# EAGLE design Rev 06_2 (EAGLE 9.6.2)
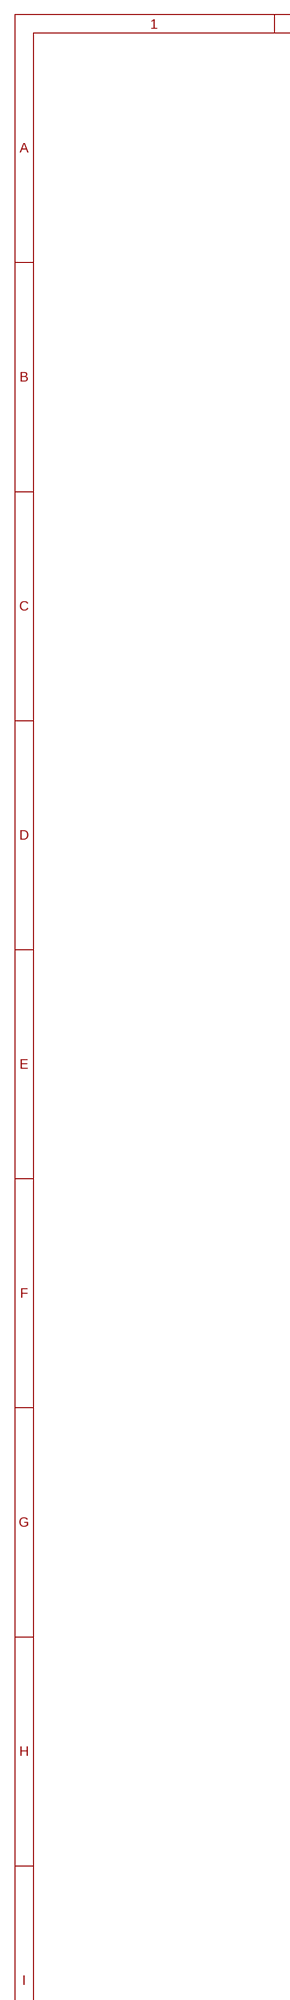
[diagram p0: schematic, sheet 1, part 1 of 2]
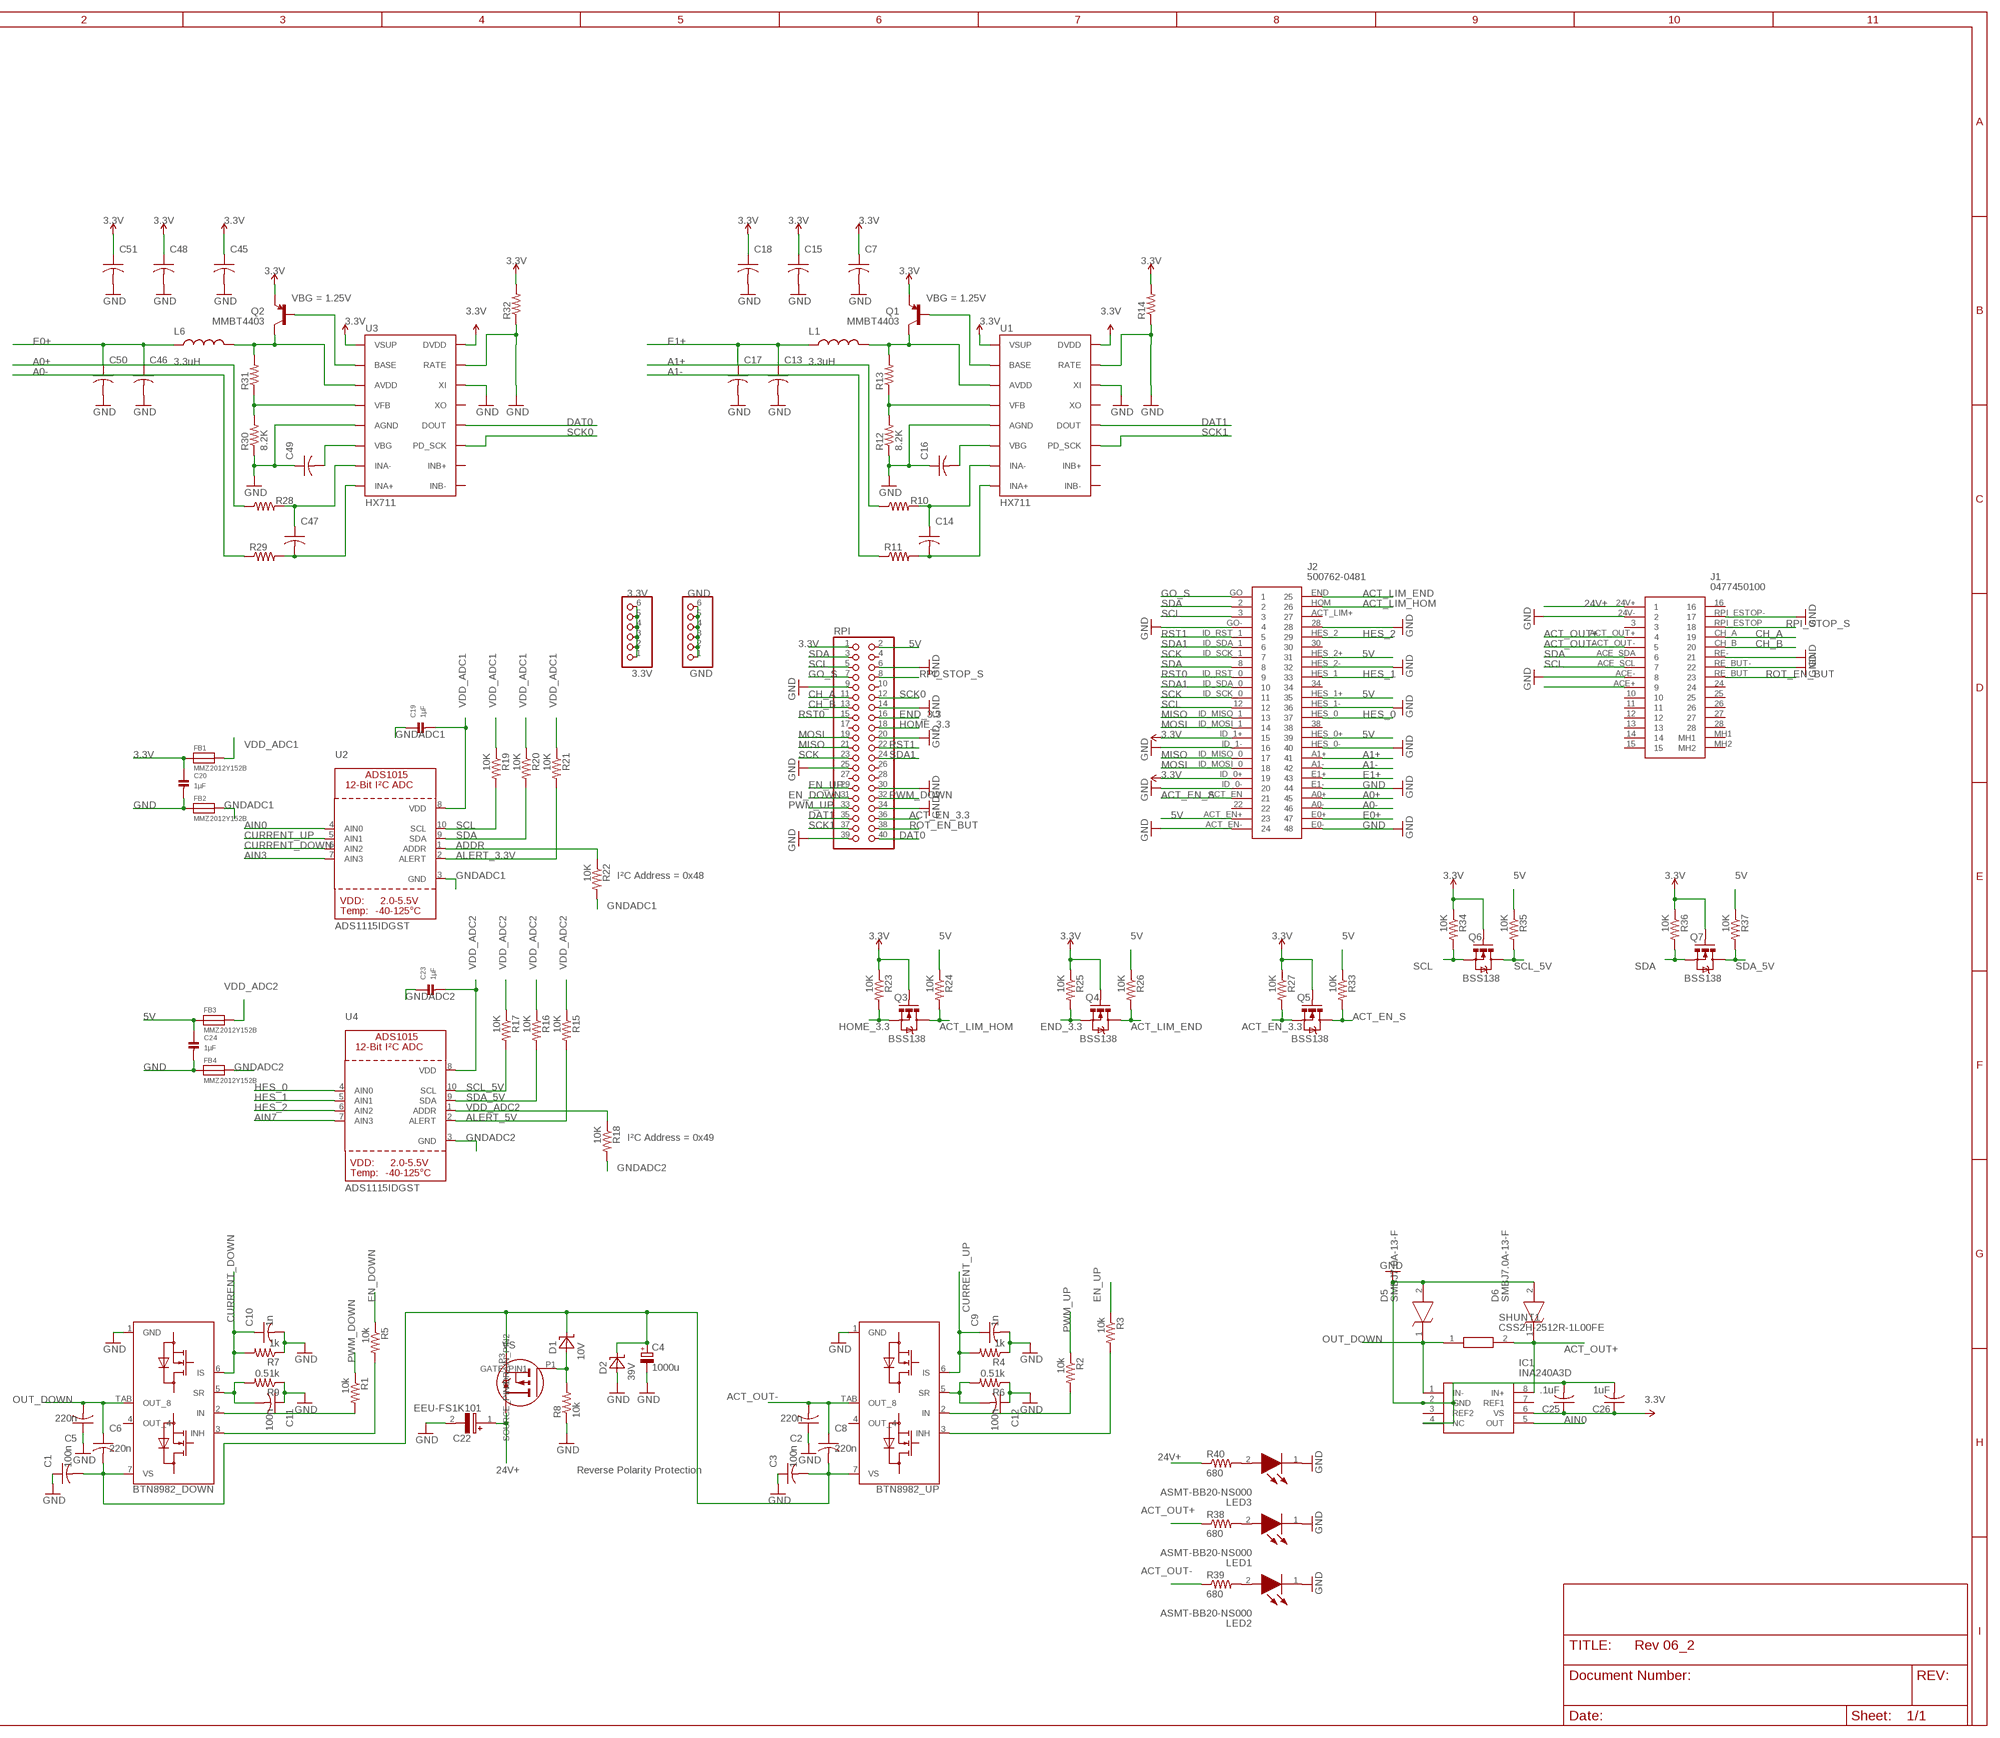
[diagram p1: schematic, sheet 1, part 2 of 2]

## Parts
3.3V  PINHD-1X6  [1X06]
BTN8982_DOWN  HW-INFINEON_BTN8982  HW-INFINEON_BTN8962TA  [HW-INFINEON_TO263-7-1]
BTN8982_UP  HW-INFINEON_BTN8982  HW-INFINEON_BTN8962TA  [HW-INFINEON_TO263-7-1]
C1  100n  C-USC0603K  [C0603K]
C2  220n  C-USC0603K  [C0603K]
C3  100n  C-USC0603K  [C0603K]
C4  1000u  RCL_CPOL-EUE5-13  [RCL_E5-13]
C5  220n  C-USC0603K  [C0603K]
C6  220n  C-USC0603K  [C0603K]
C7  10uF  C-USC1206K  [C1206K]
C8  220n  C-USC0603K  [C0603K]
C9  1n  C-USC0603K  [C0603K]
C10  1n  C-USC0603K  [C0603K]
C11  100n  C-USC0603  [C0603]
C12  100n  C-USC0603K  [C0603K]
C13  10uF  C-USC1206K  [C1206K]
C14  0.1uF  C-USC1206K  [C1206K]
C15  0.1uF  C-USC1206K  [C1206K]
C16  0.1uF  C-USC1206K  [C1206K]
C17  0.1uF  C-USC1206K  [C1206K]
C18  0.1uF  C-USC1206K  [C1206K]
C19  1µF  CAP_CERAMIC1206  [1206]
C20  1µF  CAP_CERAMIC1206  [1206]
C22  EEU-FS1K101  [CAPPRD500W65D1000H1400]
C23  1µF  CAP_CERAMIC1206  [1206]
C24  1µF  CAP_CERAMIC1206  [1206]
C25  .1uF  C-USC1206K  [C1206K]
C26  1uF  C-USC1206K  [C1206K]
C45  10uF  C-USC1206K  [C1206K]
C46  10uF  C-USC1206K  [C1206K]
C47  0.1uF  C-USC1206K  [C1206K]
C48  0.1uF  C-USC1206K  [C1206K]
C49  0.1uF  C-USC1206K  [C1206K]
C50  0.1uF  C-USC1206K  [C1206K]
C51  0.1uF  C-USC1206K  [C1206K]
D1  10V  SMD-PACKAGES_ZMM  [SMD-PACKAGES_SOD80]
D2  39V  SMD-PACKAGES_ZMMM  [SMD-PACKAGES_MELF-D]
D5  SMBJ7.0A-13-F  [DIOM5336X250N]
D6  SMBJ7.0A-13-F  [DIOM5336X250N]
FB1  MMZ2012Y152B  FERRITE0805  [0805]
FB2  MMZ2012Y152B  FERRITE0805  [0805]
FB3  MMZ2012Y152B  FERRITE0805  [0805]
FB4  MMZ2012Y152B  FERRITE0805  [0805]
GND  PINHD-1X6  [1X06]
IC0  HW_INFINEON_IPD90P04P4L-04  [HW-INFINEON_TO-252-3-313-L]
IC1  INA240A3D  [SOIC127P600X175-8N]
J1  0477450100  [0477450100]
J2  500762-0481  [500762-0481]
L1  3.3uH  INDUCTOR1210  [1210]
L6  3.3uH  INDUCTOR1210  [1210]
LED1  ASMT-BB20-NS000  [LEDM3224X250N]
LED2  ASMT-BB20-NS000  [LEDM3224X250N]
LED3  ASMT-BB20-NS000  [LEDM3224X250N]
Q1  MMBT4403  TRANSISTOR_PNPMMBT4403  [SOT23-3]
Q2  MMBT4403  TRANSISTOR_PNPMMBT4403  [SOT23-3]
Q3  BSS138  MOSFET-NCHANNELSMD  [SOT23-3]
Q4  BSS138  MOSFET-NCHANNELSMD  [SOT23-3]
Q5  BSS138  MOSFET-NCHANNELSMD  [SOT23-3]
Q6  BSS138  MOSFET-NCHANNELSMD  [SOT23-3]
Q7  BSS138  MOSFET-NCHANNELSMD  [SOT23-3]
R1  10k  RESISTOR0603-RES  [0603-RES]
R2  10k  RESISTOR0603-RES  [0603-RES]
R3  10k  RESISTOR0603-RES  [0603-RES]
R4  1k  RESISTOR0603-RES  [0603-RES]
R5  10k  RESISTOR0603-RES  [0603-RES]
R6  0.51k  RESISTOR0603-RES  [0603-RES]
R7  1k  RESISTOR0603-RES  [0603-RES]
R8  10k  RESISTOR0603-RES  [0603-RES]
R9  0.51k  RESISTOR0603-RES  [0603-RES]
R10  100  R-US_R2010  [R2010]
R11  100  R-US_R2010  [R2010]
R12  8.2K  R-US_R2010  [R2010]
R13  20k  R-US_R2010  [R2010]
R14  10K  R-US_R2010  [R2010]
R15  10K  RESISTOR2010  [R2010]
R16  10K  RESISTOR2010  [R2010]
R17  10K  RESISTOR2010  [R2010]
R18  10K  RESISTOR2010  [R2010]
R19  10K  RESISTOR2010  [R2010]
R20  10K  RESISTOR2010  [R2010]
R21  10K  RESISTOR2010  [R2010]
R22  10K  RESISTOR2010  [R2010]
R23  10K  RESISTOR2010  [R2010]
R24  10K  RESISTOR2010  [R2010]
R25  10K  RESISTOR2010  [R2010]
R26  10K  RESISTOR2010  [R2010]
R27  10K  RESISTOR2010  [R2010]
R28  100  R-US_R2010  [R2010]
R29  100  R-US_R2010  [R2010]
R30  8.2K  R-US_R2010  [R2010]
R31  20k  R-US_R2010  [R2010]
R32  10K  R-US_R2010  [R2010]
R33  10K  RESISTOR2010  [R2010]
R34  10K  RESISTOR2010  [R2010]
R35  10K  RESISTOR2010  [R2010]
R36  10K  RESISTOR2010  [R2010]
R37  10K  RESISTOR2010  [R2010]
R38  680  RESISTOR1206  [1206]
R39  680  RESISTOR1206  [1206]
R40  680  RESISTOR1206  [1206]
RPI  PINHD-2X20  [2X20]
SHUNT1  CSS2H-2512R-1L00FE  [CSS2H2512R1L00FE]
U1  HX711  HX711HX711  [SO16]
U2  ADS1115IDGST  ADC_ADS1015  [MSOP10]
U3  HX711  HX711HX711  [SO16]
U4  ADS1115IDGST  ADC_ADS1015  [MSOP10]

## Nets
3.3V: 3.3V.1 3.3V.2 3.3V.3 3.3V.4 3.3V.5 3.3V.6 C7.1 C15.1 C18.1 C20.1 C25.1 C26.1 C45.1 C48.1 C51.1 FB1.1 IC1.6(VS) J2.ID_0+ J2.ID_1+ Q1.2(E) Q2.2(E) Q3.1(G) Q4.1(G) Q5.1(G) Q6.1(G) Q7.1(G) R14.2 R23.1 R25.1 R27.1 R32.2 R34.1 R36.1 RPI.1(3.3V0) U1.1(VSUP) U1.16(DVDD) U3.1(VSUP) U3.16(DVDD) ; supply symbol labelled VDD, VCC, LV
5V: C24.1 FB3.1 J2.ACT_EN+ J2.HES_0+ J2.HES_1+ J2.HES_2+ R24.1 R26.1 R33.1 R35.1 R37.1 RPI.2(5V0)
24V+: C22.1(+) IC0.P2(DRAIN_PIN2) J1.24V+ R40.1
A0+: J2.A0+ R28.1
A0-: J2.A0- R29.1
A1+: J2.A1+ R10.1
A1-: J2.A1- R11.1
ACT_EN_3.3: Q5.2(S) R27.2 RPI.36
ACT_EN_S: J2.ACT_EN Q5.3(D) R33.2
ACT_LIM_END: J2.END Q4.3(D) R26.2
ACT_LIM_HOM: J2.HOM Q3.3(D) R24.2
ACT_OUT+: D6.1(K) IC1.8(IN+) J1.ACT_OUT+ R38.1 SHUNT1.2
ACT_OUT-: BTN8982_UP.TAB(OUT_8) C2.2 C8.1 J1.ACT_OUT- R39.1
ADDR: R22.1 U2.1(ADDR)
AIN0: IC1.5(OUT) U2.4(AIN0)
AIN3: U2.7(AIN3)
AIN7: U4.7(AIN3)
ALERT_3.3V: R21.2 U2.2(ALERT)
ALERT_5V: R15.2 U4.2(ALERT)
CH_A: J1.CH_A RPI.11
CH_B: J1.CH_B RPI.13
CURRENT_DOWN: BTN8982_DOWN.6(IS) C10.1 R7.2 U2.6(AIN2)
CURRENT_UP: BTN8982_UP.6(IS) C9.1 R4.2 U2.5(AIN1)
DAT0: RPI.40 U3.12(DOUT)
DAT1: RPI.35 U1.12(DOUT)
E0+: C46.1 C50.1 J2.E0+ L6.1
E1+: C13.1 C17.1 J2.E1+ L1.1
EN_DOWN: R5.1 RPI.31
EN_UP: R3.1 RPI.29
END_3.3: Q4.2(S) R25.2 RPI.16
GND: BTN8982_DOWN.1(GND) BTN8982_UP.1(GND) C1.1 C2.1 C3.1 C4.- C5.1 C7.2 C9.2 C10.2 C11.1 C12.1 C13.2 C15.2 C16.1 C17.2 C18.2 C20.2 C22.2(-) C24.2 C25.2 C26.2 C45.2 C46.2 C48.2 C49.1 C50.2 C51.2 D2.A D5.2(A) D6.2(A) FB2.1 FB4.1 GND.1 GND.2 GND.3 GND.4 GND.5 GND.6 IC1.2(GND) IC1.4(NC) J1.24V- J1.ACE- J1.RE- J1.RE_BUT- J1.RPI_ESTOP- J2.28 J2.ACT_EN- J2.E0- J2.E1- J2.GO- J2.HES_0- J2.HES_1- J2.HES_2- J2.ID_0- J2.ID_1- LED1.1(K) LED2.1(K) LED3.1(K) R4.1 R6.1 R7.1 R8.1 R9.1 R12.1 R14.1 R30.1 R32.1 RPI.6(GND4) RPI.9(GND0) RPI.14(GND5) RPI.20(GND6) RPI.25(GND1) RPI.30(GND7) RPI.34(GND8) RPI.39(GND3) U1.5(AGND) U1.14(XI) U1.15(RATE) U3.5(AGND) U3.14(XI) U3.15(RATE)
GNDADC1: C19.1 FB2.2 R22.2 U2.3(GND)
GNDADC2: C23.1 FB4.2 R18.2 U4.3(GND)
GO_S: J2.GO RPI.7
HES_0: J2.HES_0 U4.4(AIN0)
HES_1: J2.HES_1 U4.5(AIN1)
HES_2: J2.HES_2 U4.6(AIN2)
HOME_3.3: Q3.2(S) R23.2 RPI.18
IN2: BTN8982_UP.2(IN) R2.2
INH1: BTN8982_DOWN.3(INH) R5.2
INH2: BTN8982_UP.3(INH) R3.2
MISO: J2.ID_MISO_0 J2.ID_MISO_1 RPI.21
MOSI: J2.ID_MOSI_0 J2.ID_MOSI_1 RPI.19
N$1: BTN8982_DOWN.2(IN) R1.2
N$2: Q1.1(B) U1.2(BASE)
N$3: R12.2 R13.1 U1.4(VFB)
N$4: C16.2 U1.6(VBG)
N$5: L1.2 Q1.3(C) R13.2 U1.3(AVDD)
N$6: C14.1 R10.2 U1.7(INA-)
N$7: C14.2 R11.2 U1.8(INA+)
N$8: LED1.2(A) R38.2
N$9: D1.A IC0.P1(GATE_PIN1) R8.2
N$10: LED2.2(A) R39.2
N$11: LED3.2(A) R40.2
N$12: J1.ACE+
N$56: Q2.1(B) U3.2(BASE)
N$63: R30.2 R31.1 U3.4(VFB)
N$64: C49.2 U3.6(VBG)
N$65: L6.2 Q2.3(C) R31.2 U3.3(AVDD)
N$67: C47.1 R28.2 U3.7(INA-)
N$68: C47.2 R29.2 U3.8(INA+)
OUT_DOWN: BTN8982_DOWN.TAB(OUT_8) C5.2 C6.1 D5.1(K) IC1.1(IN-) SHUNT1.1
PWM_DOWN: R1.1 RPI.32
PWM_UP: R2.1 RPI.33
ROT_EN_BUT: J1.RE_BUT RPI.38
RPI_STOP_S: J1.RPI_ESTOP RPI.8
RST0: J2.ID_RST_0 RPI.15
RST1: J2.ID_RST_1 RPI.22
SCK: J2.ID_SCK_0 J2.ID_SCK_1 RPI.23
SCK0: RPI.12 U3.11(PD_SCK)
SCK1: RPI.37 U1.11(PD_SCK)
SCL: J1.ACE_SCL J2.3 J2.12 Q6.2(S) R19.2 R34.2 RPI.5 U2.10(SCL)
SCL_5V: Q6.3(D) R17.2 R35.2 U4.10(SCL)
SDA: J1.ACE_SDA J2.2 J2.8 Q7.2(S) R20.2 R36.2 RPI.3 U2.9(SDA)
SDA1: J2.ID_SDA_0 J2.ID_SDA_1 RPI.24
SDA_5V: Q7.3(D) R16.2 R37.2 U4.9(SDA)
SR1: BTN8982_DOWN.5(SR) C11.2 R9.2
SR2: BTN8982_UP.5(SR) C12.2 R6.2
VDD_ADC1: C19.2 FB1.2 R19.1 R20.1 R21.1 U2.8(VDD)
VDD_ADC2: C23.2 FB3.2 R15.1 R16.1 R17.1 R18.1 U4.1(ADDR) U4.8(VDD)
VS: BTN8982_DOWN.7(VS) BTN8982_UP.7(VS) C1.2 C3.2 C4.+ C6.2 C8.2 D1.K(C) D2.K(C) IC0.P3(SOURCE_PIN3)
Unconnected: BTN8982_DOWN.4(OUT_4) BTN8982_UP.4(OUT_4) IC1.3(REF2) IC1.7(REF1) J1.3 J1.10 J1.11 J1.12 J1.13 J1.14 J1.15 J1.16 J1.24 J1.25 J1.26 J1.27 J1.28 J1.MH1 J1.MH2 J2.22 J2.30 J2.34 J2.38 J2.ACT_LIM+ RPI.4(5V1) RPI.10 RPI.17(3.3V1) RPI.26 RPI.27(---------------) RPI.28(---) U1.9(INB-) U1.10(INB+) U1.13(XO) U3.9(INB-) U3.10(INB+) U3.13(XO)

## Notes on the sheet
- VBG = 1.25V | VBG = 1.25V
- I²C Address = 0x48
- I²C Address = 0x49
- Reverse Polarity Protection

## Library data of the parts
3.3V GND = adafruit:PINHD-1X6: PIN HEADER
BTN8982_DOWN BTN8982_UP = NovalithIC_H-Bridge_Demo_Board_V2_2:HW-INFINEON_BTN8962TA
C1-C3 C5-C18 C25 C26 C45-C51 = rcl:C-US: CAPACITOR, American symbol; SPICEPREFIX: C
C4 = NovalithIC_H-Bridge_Demo_Board_V2_2:RCL_CPOL-EU: POLARIZED CAPACITOR, European symbol
C19 C20 C23 C24 = microbuilder:CAP_CERAMIC: Ceramic Capacitors 0402 - 0402 Surface Mount Capacitors 16pF 50V 5% [Digikey: 445-4899-2-ND] 18pF 50V 5% [Digikey: 490-1281-2-ND] 22pF 50V 5% [Digikey: 490-1283-2-ND] 68pF 50V 5% [Digikey: 490-1289-2-ND] 0.1uF 10V 10% [Digikey: 490-1318-2-ND] 1.0uF 6.3V 10% [Digikey: 490-1320-2-ND] 0603 - 0603 Surface Mount Capacitors 16 pF 50V 5% [Digikey: 445-5051-2-ND] 22 pF 50V [Digikey: PCC220ACVTR-ND] 33 pF 50V 5% [Digikey: 490-1415-1-ND] 56pF 50V 5% [Digikey: 490-1421-1-ND] 220pF 50V 5% [Digikey: 445-1285-1-ND] 680 pF 50V 2200 pF 50V 5% C0G [Digikey: 445-1297-1-ND] 5600 pF 100V 5% X7R [Digikey: 478-3711-1-ND] 0.1 µF 25V 10% [Digikey: PCC2277TR-ND] 0.22 µF 16V 10% X7R [Digikey: 445-1318-1-ND] 1.0 µF 25V 10% [Digikey: 445-5146-2-ND] 0603 - RF Specific 3pF 250V +/-0.1pF RF [Digikey: 712-1347-1-ND] 18 pF 250V 5% [Digikey: 478-3505-1-ND or 712-1322-1-ND] 56 pF 250V 5% C0G RF [Digikey: 490-4867-1-ND] 68 pF 250V RF [Digikey: 490-4868-1-ND] 0805 - 0805 Surface Mount Capacitors 220 pF 250V 2% RF Ceramic Capacitor [Digikey: 712-1398-1-ND] 1000 pF 50V 2% NP0 Ceramic Capacitor [Digikey: 478-3760-1-ND] 0.1 µF 25V 10% Ceramic Capacitor [Digikey: PCC1828TR-ND] 1.0 µF 16V 10% Ceramic Capacitor[Digikey: 490-1691-2-ND] 10.0 µF 10V 10% Ceramic Capacitor[Digikey: 709-1228-1-ND] 10.0 uF 16V 10% Ceramic Capacitor [Digikey: 478-5165-2-ND] 47 uF 6.3V 20% Ceramic Capacitor [Digikey: 587-1779-1-ND or 399-5506-1-ND] 1206 - 1206 Surface Mount Capacitors 47uF 10V 20% Ceramic Capacitor [Digikey: 490-5528-1-ND or 399-5508-1-ND or 445-6010-1-ND] 100uF 6.3V -20%, +80% Y5V Ceramic Capacitor (Digikey: 490-4512-1-ND, Mouser: 81-GRM31CF50J107ZE1L)
C22 = EEU-FS1K101:EEU-FS1K101: Aluminum Electrolytic Capacitors - Radial Leaded 80VDC 100uF 600mA Polar Source: Datasheet <http://industrial.panasonic.com/cdbs/www-data/pdf/RDF0000/ABA0000C1255.pdf>; ARROW_PART_NUMBER: EEU-FS1K101; ARROW_PRICE-STOCK: https://www.arrow.com/en/products/eeu-fs1k101/panasonic?region=nac; DESCRIPTION: Aluminum Electrolytic Capacitors - Radial Leaded 80VDC 100uF 600mA Polar; HEIGHT: 14mm; MANUFACTURER_NAME: Panasonic; MANUFACTURER_PART_NUMBER: EEU-FS1K101; MOUSER_PART_NUMBER: 667-EEU-FS1K101; MOUSER_PRICE-STOCK: https://www.mouser.co.uk/ProductDetail/Panasonic/EEU-FS1K101?qs=w%2Fv1CP2dgqpI89RhWErXfg%3D%3D
D1 D2 = NovalithIC_H-Bridge_Demo_Board_V2_2:SMD-PACKAGES_ZMM: Werte: 1V, 2,7V ...51V Reihe E24
D5 D6 = SMBJ7.0A-13-F:SMBJ7.0A-13-F: ESD Suppressors / TVS Diodes 600W 7.0V Source: Datasheet <https://www.diodes.com/assets/Datasheets/ds19002.pdf>; ARROW_PART_NUMBER: SMBJ7.0A-13-F; ARROW_PRICE-STOCK: https://www.arrow.com/en/products/smbj7.0a-13-f/diodes-incorporated?region=nac; DESCRIPTION: ESD Suppressors / TVS Diodes 600W 7.0V; HEIGHT: 2.5mm; MANUFACTURER_NAME: Diodes Inc.; MANUFACTURER_PART_NUMBER: SMBJ7.0A-13-F; MOUSER_PART_NUMBER: 621-SMBJ7.0A-13-F; MOUSER_PRICE-STOCK: https://www.mouser.co.uk/ProductDetail/Diodes-Incorporated/SMBJ70A-13-F?qs=gaDBXWSqsDCxwFOt1XoPyw%3D%3D
FB1-FB4 = microbuilder:FERRITE: Ferrite Bead 0603 MMZ1608B121C - 120 Ohm, 600mA Ferrite Chip - Digikey: 445-2164-1-ND BK1608HW121-T - 120 Ohm, 600mA Ferrite Chip - Digikey: 587-1876-2-ND 0805 HZ0805B272R-10 - 2.7K Ohm @ 100MHz, 200mA 0.8 Ohm DC Resistance - Digikey: 240-2504-1-ND (see also Murata BLM21BD272SN1L)
IC0 = NovalithIC_H-Bridge_Demo_Board_V2_2:HW_INFINEON_IPD90P04P4L-04
IC1 = INA240A3D:INA240A3D: 80V, Low-/High-Side, Bi-Directional, Zero-Drift, Current Sense Amp w/Enhanced PWM Rejection Source: Datasheet <http://www.ti.com/lit/gpn/INA240>; ARROW_PART_NUMBER: INA240A3D; ARROW_PRICE-STOCK: https://www.arrow.com/en/products/ina240a3d/texas-instruments; DESCRIPTION: 80V, Low-/High-Side, Bi-Directional, Zero-Drift, Current Sense Amp w/Enhanced PWM Rejection; HEIGHT: 1.75mm; MANUFACTURER_NAME: Texas Instruments; MANUFACTURER_PART_NUMBER: INA240A3D; MOUSER_PART_NUMBER: 595-INA240A3D; MOUSER_PRICE-STOCK: https://www.mouser.co.uk/ProductDetail/Texas-Instruments/INA240A3D?qs=u4fy%2FsgLU9Mkzv3nsq%252BxLA%3D%3D
J1 = 0477450100:0477450100: Conn CMC PIN 28 POS Solder RA Thru-Hole Automotive Carton Source: Datasheet <https://www.molex.com/pdm_docs/sd/477450100_sd.pdf>; ARROW_PART_NUMBER: 0477450100; ARROW_PRICE-STOCK: https://www.arrow.com/en/products/0477450100/molex; DESCRIPTION: Conn CMC PIN 28 POS Solder RA Thru-Hole Automotive Carton; HEIGHT: 28mm; MANUFACTURER_NAME: Molex; MANUFACTURER_PART_NUMBER: 0477450100
J2 = 500762-0481:500762-0481: CMC Header Right Angle 48 Circuits Molex 500762-0481, 48 Way 4 Row Black CMC Series Male Through Hole Header, Solder Termination Source: Datasheet <https://datasheet.datasheetarchive.com/originals/distributors/Datasheets_SAMA/7c53a4fb757944cf2c1fd37c9b3ea65a.pdf>; DESCRIPTION: CMC Header Right Angle 48 Circuits Molex 500762-0481, 48 Way 4 Row Black CMC Series Male Through Hole Header, Solder Termination; HEIGHT: mm; MANUFACTURER_NAME: Molex; MANUFACTURER_PART_NUMBER: 500762-0481; MOUSER_PART_NUMBER: 538-500762-0481; MOUSER_PRICE-STOCK: https://www.mouser.co.uk/ProductDetail/Molex/500762-0481?qs=xbccQsLEe0dknz6%252B2aFPdA%3D%3D
L1 L6 = SparkFun-Passives:INDUCTOR: Inductors Basic Inductor/Choke - 0603 and 1206. Footprints are not proven and vary greatly between part numbers. INDUCTOR POWER 3.3UH 4.0A SMD 0.197" L x 0.197" W x 0.177" H (5.00mm x 5.00mm x 4.50mm)
LED1-LED3 = ASMT-BB20-NS000:ASMT-BB20-NS000: 3.2 V Blue LED 3224 (1209) SMD, Broadcom ASMT-BB20-NS000 Source: Datasheet <https://docs.broadcom.com/docs/AV02-0389EN>; DESCRIPTION: 3.2 V Blue LED 3224 (1209) SMD, Broadcom ASMT-BB20-NS000; HEIGHT: 2.5mm; MANUFACTURER_NAME: Avago Technologies; MANUFACTURER_PART_NUMBER: ASMT-BB20-NS000; MOUSER_PART_NUMBER: 630-ASMT-BB20-NS000; MOUSER_PRICE-STOCK: https://www.mouser.co.uk/ProductDetail/Broadcom-Avago/ASMT-BB20-NS000?qs=ZNK0BnemlqHu9jR9EAVrBw%3D%3D
Q1 Q2 = SparkFun-DiscreteSemi:TRANSISTOR_PNP: Generic PNP BJT Double check pinouts against datasheets- not all devices are the same! MMBT3906 - 40V 200mA SOT-23 (TRANS-08052) MMBT4403 - 40V 600mA SOT-23 (TRANS-09245); PROD_ID: TRANS-09245
Q3-Q7 = SparkFun:MOSFET-NCHANNEL
R1-R9 R15-R27 R33-R40 = SparkFun:RESISTOR: Resistor Basic schematic elements and footprints for 0603, 1206, and PTH resistors.
R10-R14 R28-R32 = rcl:R-US_: RESISTOR, American symbol; SPICEPREFIX: R
RPI = Raspberry Pi Headers:PINHD-2X20: PIN HEADER
SHUNT1 = CSS2H-2512R-1L00FE:CSS2H-2512R-1L00FE: Res Metal Strip 2512 0.001 Ohm 1% 5W +/-75ppm/C Pad SMD Automotive T/R Source: Datasheet <http://www.bourns.com/docs/Product-Datasheets/css2h-2512.pdf>; ARROW_PART_NUMBER: CSS2H-2512R-1L00FE; ARROW_PRICE-STOCK: https://www.arrow.com/en/products/css2h-2512r-1l00fe/bourns?region=nac; DESCRIPTION: Res Metal Strip 2512 0.001 Ohm 1% 5W +/-75ppm/C Pad SMD Automotive T/R; HEIGHT: 0.87mm; MANUFACTURER_NAME: Bourns; MANUFACTURER_PART_NUMBER: CSS2H-2512R-1L00FE; MOUSER_PART_NUMBER: 652-CSS2H2512R1L00FE; MOUSER_PRICE-STOCK: https://www.mouser.co.uk/ProductDetail/Bourns/CSS2H-2512R-1L00FE?qs=jDo7WO9B8muVb3lAsH3s1A%3D%3D
U1 U3 = Testing:HX711; PROD_ID: IC-12445
U2 U4 = microbuilder:ADC_ADS1015: ADS1015 - 12-bit 4-Channel I2C ADC with Internal PGA VDD: 2.0-5.5V Sampling Rate: 3.3ksps Gain Settings: 2/3, 1, 2, 4, 8, 16 I2C Address: ADDR low = 1001000x, ADDR high = 1001001x Internal Comparator The ADS1015 includes an internal comparator that can be set to output a high-level on ALERT when the conversion results exceeeds a pre-defined upper level, and will deassert itself when the level falls below a pre-defined lower threshold level. It can also be set to windowed mode where the ALERT pin will be asserted if the data exceeds the upper threshold or falls below the lower threshold.

## Board
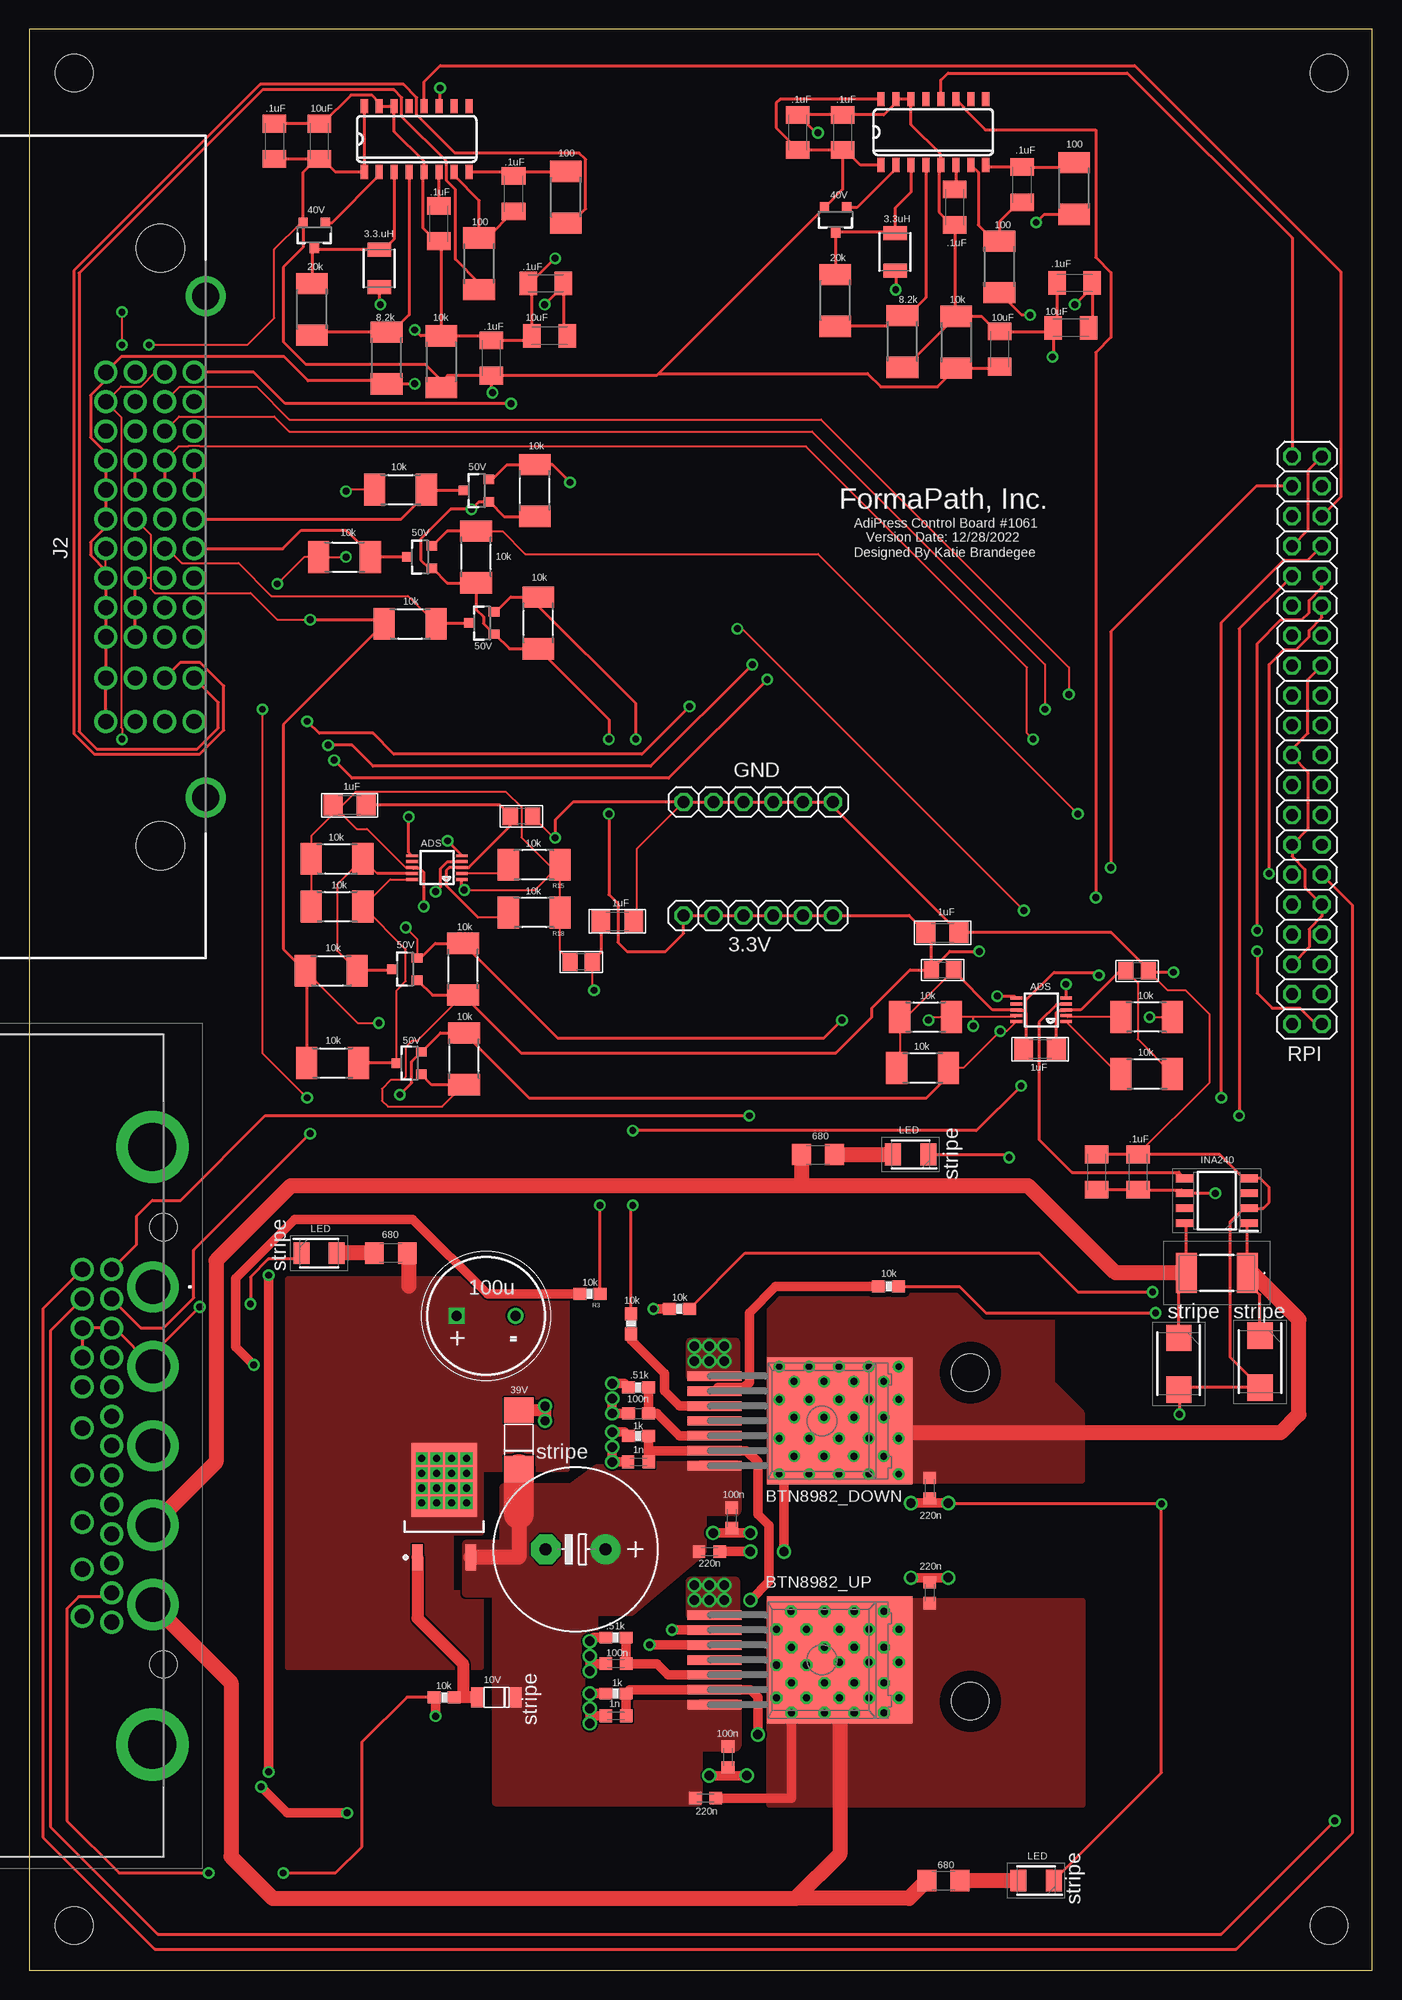
[diagram p2: board, top side]
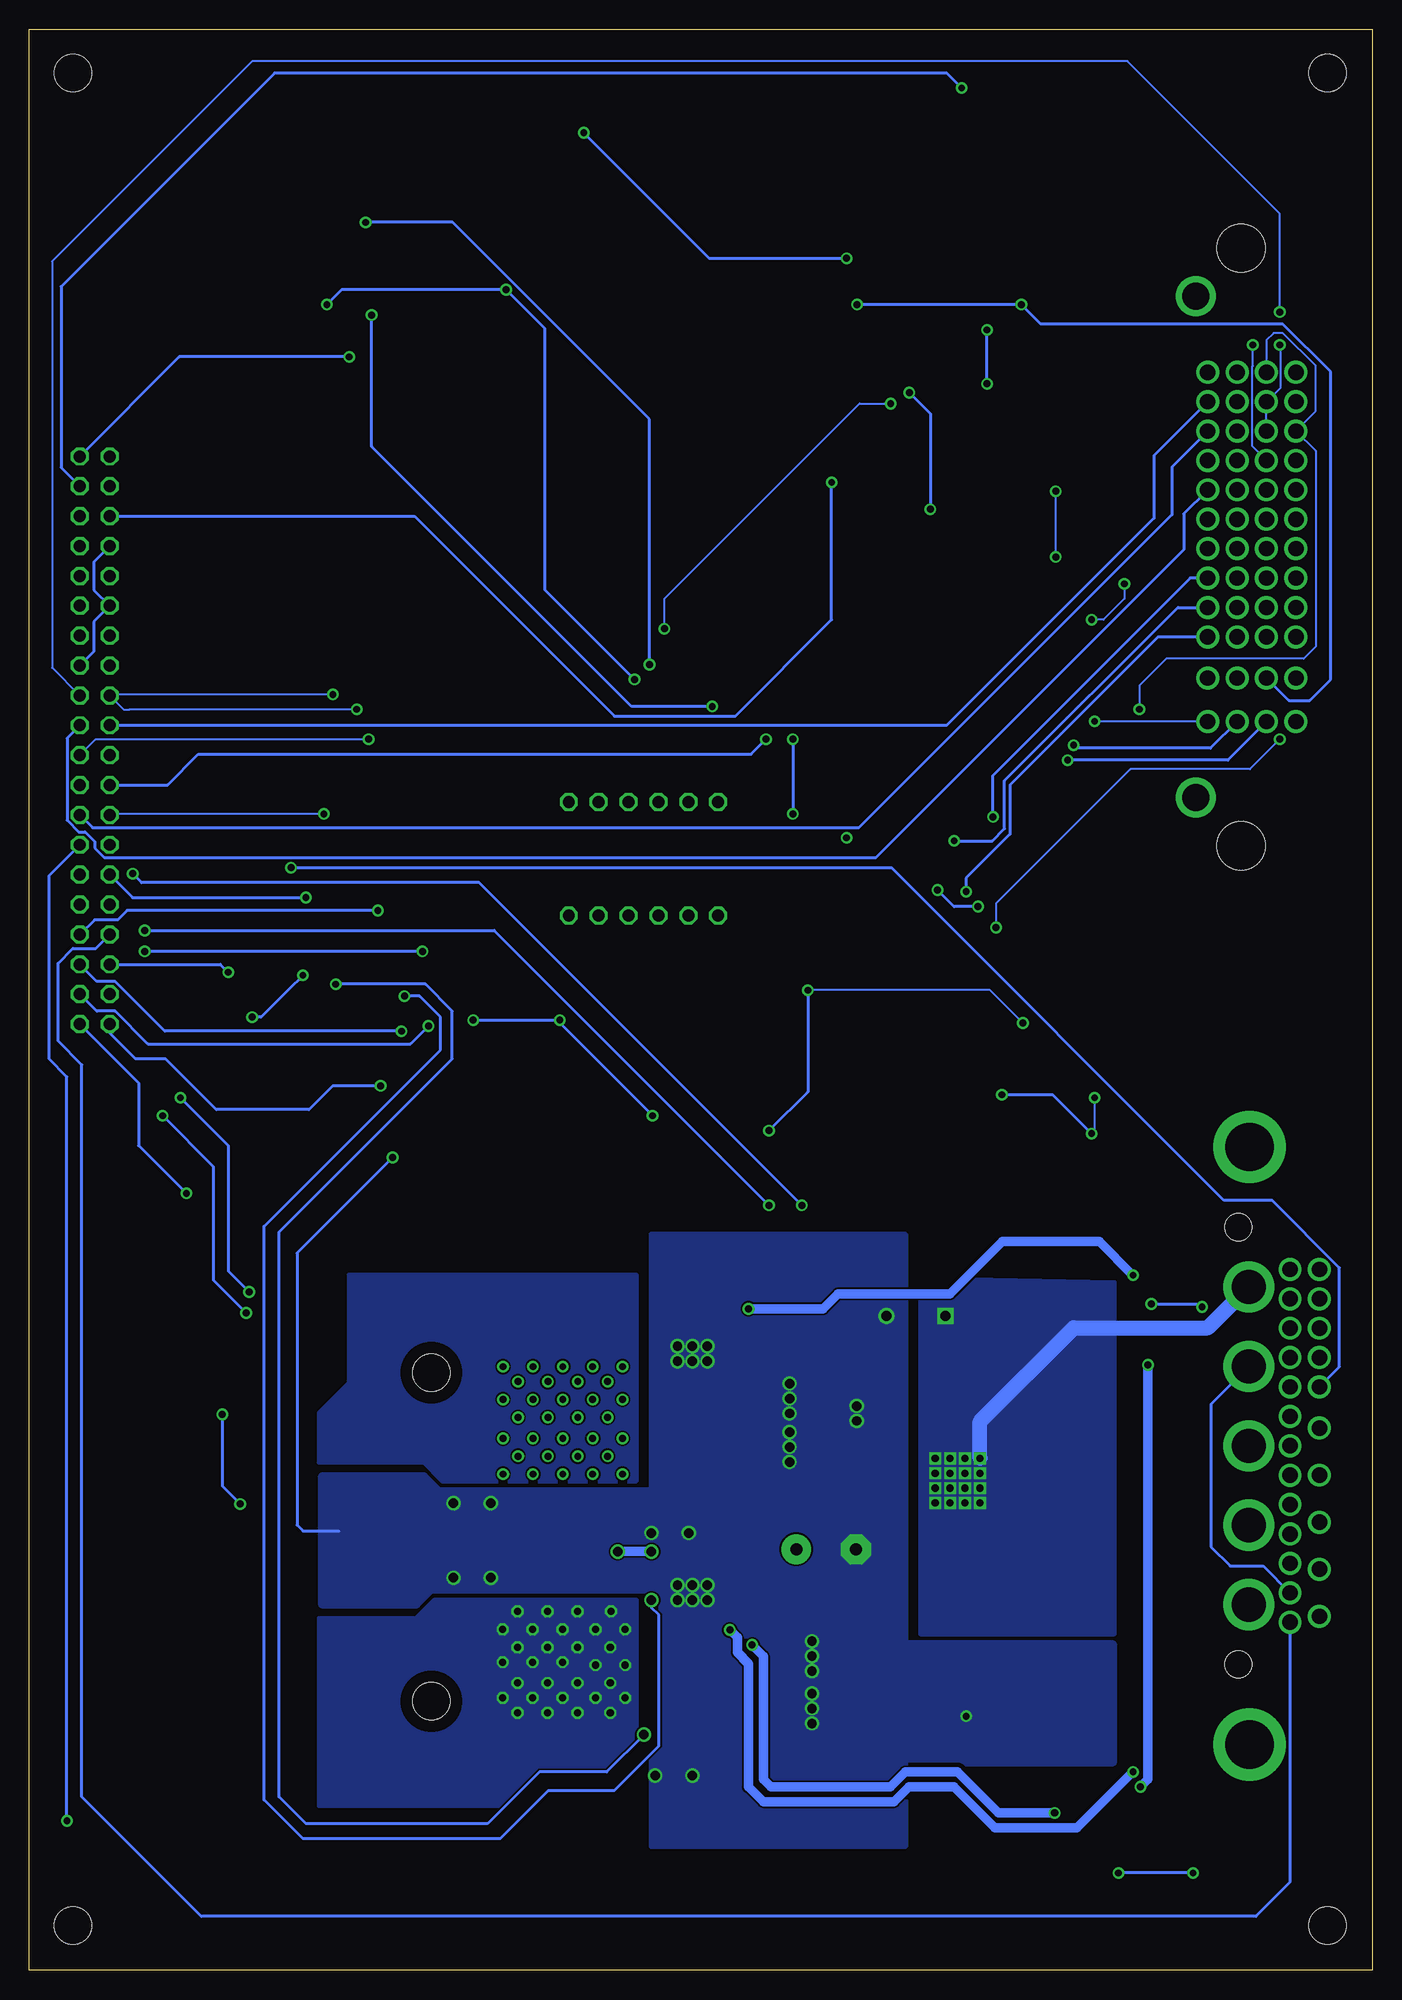
[diagram p3: board, bottom side, seen from below]

Size 114.19 x 165 mm. Coordinates in mm from the lower left corner, seen from the top.
Outline: 0,0 114.19,0 114.19,165 0,165 0,0
Copper layers (1*16): Top 0.07mm / dielectric 1.5mm / Bottom 0.07mm
Design rules "default *": minimum track width 6mil, minimum drill 23mil, track to track 6mil, track to pad 6mil, pad to pad 6mil, via to via 6mil, smd to smd 6mil, copper to edge 40mil, drill to drill 8mil, minimum pad ring 10mil, minimum via ring 8mil, stop-mask expansion 4mil, vias tented up to drill 0mil, thermal gap 10mil
Holes 3.17 mm at 3.81,161.29 110.49,161.29 3.81,3.81 110.49,3.81 80.01,50.8 80.01,22.86

### Footprints (pad centres in the part's own frame; a part is rotated, then mirrored left to right if it is on the bottom)
1X06 = drill 1.016 octagon: 1 -6.35,0; 2 -3.81,0; 3 -1.27,0; 4 1.27,0; 5 3.81,0; 6 6.35,0
HW-INFINEON_TO263-7-1 = smd 0.8 x 4.6: 1 -3.81,-9.15; 2 -2.54,-9.15; 3 -1.27,-9.15; 4 0,-9.15; 5 1.27,-9.15; 6 2.54,-9.15; 7 3.81,-9.15 | smd 10.8 x 12.4: TAB 0,1.5
C0603K = smd 1.05 x 1.08: 1 -0.875,0; 2 0.875,0
RCL_E5-13 = drill 1.016 pad 2.54: + -2.54,0 | drill 1.016 pad 2.54 octagon: - 2.54,0
C1206K = smd 1.5 x 2: 1 -1.5,0; 2 1.5,0
C0603 = smd 1.1 x 1: 1 -0.85,0; 2 0.85,0
1206 = smd 1.6 x 1.8: 1 -1.4,0; 2 1.4,0
CAPPRD500W65D1000H1400 = drill 0.85 pad 1.275 square: 1 0,0 | drill 0.85 pad 1.275: 2 5,0
SMD-PACKAGES_SOD80 = smd 1 x 1.7: A -1.65,0; K 1.65,0
SMD-PACKAGES_MELF-D = smd 2.2 x 2.5: A -2.5,0; K 2.5,0
DIOM5336X250N = smd 2.25 x 2.15: 1 -2.2,0; 2 2.2,0
0805 = smd 1.3 x 1.5: 1 -0.95,0; 2 0.95,0
HW-INFINEON_TO-252-3-313-L = smd 2.25 x 0.9: P1 -4.3,2.28; P3 -4.3,-2.28 | smd 6.3 x 5.55: P2 2.3,0
SOIC127P600X175-8N = smd 1.528 x 0.65: 1 -2.711,1.905; 2 -2.711,0.635; 3 -2.711,-0.635; 4 -2.711,-1.905; 5 2.711,-1.905; 6 2.711,-0.635; 7 2.711,0.635; 8 2.711,1.905
0477450100 = drill 2.91 pad 4.365: 3 -18.575,3.5; 24V+ -32.08,3.5; 24V- -25.325,3.5; ACT_OUT+ -11.825,3.5; ACT_OUT- -5.08,3.5 | drill 1.3 pad 1.95: 10 -23.58,0; 11 -21.08,0; 12 -18.58,0; 13 -16.08,0; 14 -13.58,0; 15 -11.08,0; 16 -8.58,0; 24 -20.085,-2.5; 25 -16.085,-2.5; 26 -12.085,-2.5; 27 -8.085,-2.5; 28 -4.08,-2.5; ACE+ -26.08,0; ACE- -28.58,0; ACE_SCL -31.08,0; ACE_SDA -33.58,0; CH_A -33.58,-2.5; CH_B -31.08,-2.5; RE- -28.58,-2.5; RE_BUT -23.58,-2.5; RE_BUT- -26.08,-2.5; RPI_ESTOP -3.58,0; RPI_ESTOP- -6.08,0 | drill 4.1 pad 6.15: MH1 -43.98,3.45; MH2 6.82,3.45 | hole 2.3: -37.155,4.4; 0,4.4
500762-0481 = drill 1.3 pad 1.9: 2 -14.85,-3.5; 3 -14.85,-6; 8 -12.35,-8.5; 12 -9.85,-8.5; 22 -2.35,-3.5; 28 0.15,-8.5; 30 2.65,-3.5; 34 5.15,-3.5; 38 7.65,-3.5; A0+ 14.85,-1; A0- 14.85,-3.5; A1+ 11.15,-1; A1- 11.15,-3.5; ACT_EN -2.35,-1; ACT_EN+ -2.35,-6; ACT_EN- -2.35,-8.5; ACT_LIM+ 0.15,-6; E0+ 14.85,-6; E0- 14.85,-8.5; E1+ 11.15,-6; E1- 11.15,-8.5; END 0.15,-1; GO -14.85,-1; GO- -14.85,-8.5; HES_0 7.65,-1; HES_0+ 7.65,-6; HES_0- 7.65,-8.5; HES_1 5.15,-1; HES_1+ 5.15,-6; HES_1- 5.15,-8.5; HES_2 2.65,-1; HES_2+ 2.65,-6; HES_2- 2.65,-8.5; HOM 0.15,-3.5; ID_0+ -4.85,-6; ID_0- -4.85,-8.5; ID_1+ -7.35,-6; ID_1- -7.35,-8.5; ID_MISO_0 -4.85,-1; ID_MISO_1 -7.35,-1; ID_MOSI_0 -4.85,-3.5; ID_MOSI_1 -7.35,-3.5; ID_RST_0 -9.85,-1; ID_RST_1 -12.35,-1; ID_SCK_0 -9.85,-6; ID_SCK_1 -12.35,-6; ID_SDA_0 -9.85,-3.5; ID_SDA_1 -12.35,-3.5 | drill 2.3 pad 3.4: 50 21.3,0; 51 -21.3,0 | hole 4.1: 25.4,-3.85; -25.4,-3.85
1210 = smd 1.2 x 2: 1 -1.6,0; 2 1.6,0
LEDM3224X250N = smd 1.35 x 1.85: 1 -1.5,0; 2 1.5,0
SOT23-3 = smd 0.8 x 0.9: 1 -0.95,-1; 2 0.95,-1; 3 0,1.1
0603-RES = smd 1.1 x 1: 1 -0.85,0; 2 0.85,0
R2010 = smd 1.8 x 2.7: 1 -2.2,0; 2 2.2,0
2X20 = drill 1.016 octagon: 1 -24.13,-1.27; 2 -24.13,1.27; 3 -21.59,-1.27; 4 -21.59,1.27; 5 -19.05,-1.27; 6 -19.05,1.27; 7 -16.51,-1.27; 8 -16.51,1.27; 9 -13.97,-1.27; 10 -13.97,1.27; 11 -11.43,-1.27; 12 -11.43,1.27; 13 -8.89,-1.27; 14 -8.89,1.27; 15 -6.35,-1.27; 16 -6.35,1.27; 17 -3.81,-1.27; 18 -3.81,1.27; 19 -1.27,-1.27; 20 -1.27,1.27; 21 1.27,-1.27; 22 1.27,1.27; 23 3.81,-1.27; 24 3.81,1.27; 25 6.35,-1.27; 26 6.35,1.27; 27 8.89,-1.27; 28 8.89,1.27; 29 11.43,-1.27; 30 11.43,1.27; 31 13.97,-1.27; 32 13.97,1.27; 33 16.51,-1.27; 34 16.51,1.27; 35 19.05,-1.27; 36 19.05,1.27; 37 21.59,-1.27; 38 21.59,1.27; 39 24.13,-1.27; 40 24.13,1.27
CSS2H2512R1L00FE = smd 1.8 x 3.4: 1 -2.6,0; 2 2.6,0
SO16 = smd 0.6 x 1.2: 1 -4.445,-2.8; 2 -3.175,-2.8; 3 -1.905,-2.8; 4 -0.635,-2.8; 5 0.635,-2.8; 6 1.905,-2.8; 7 3.175,-2.8; 8 4.445,-2.8; 9 4.445,2.8; 10 3.175,2.8; 11 1.905,2.8; 12 0.635,2.8; 13 -0.635,2.8; 14 -1.905,2.8; 15 -3.175,2.8; 16 -4.445,2.8
MSOP10 = smd 0.25 x 1: 1 -1,-2.113; 2 -0.5,-2.113; 3 0,-2.113; 4 0.5,-2.113; 5 1,-2.113; 6 1,2.113; 7 0.5,2.113; 8 0,2.113; 9 -0.5,2.113; 10 -1,2.113

### Placement (x,y rotation side)
3.3V  61.98,89.66 180 top
BTN8982_DOWN  67.4,46.7 270 top
BTN8982_UP  67.4,26.38 270 top
C1  59.72,38.44 90 top
C2  76.55,32.09 270 top
C3  59.4,18.12 90 top
C4  46.45,35.77 180 top
C5  76.55,40.98 90 top
C6  57.81,35.58 180 top
C7  24.66,155.48 90 top
C8  57.49,14.63 180 top
C9  49.88,21.61 180 top
C10  51.78,43.2 180 top
C11  51.78,47.33 0 top
C12  49.88,26.06 0 top
C13  44.23,138.96 180 top
C14  41.17,151.04 90 top
C15  20.85,155.48 90 top
C16  34.82,148.5 90 top
C17  43.91,143.4 180 top
C18  39.26,137.07 90 top
C19  85.93,78.29 180 top
C20  77.64,88.21 0 top
C22  36.32,55.63 0 top
C23  27.23,99.04 180 top
C24  49.99,89.17 0 top
C25  94.27,67.84 90 top
C26  90.74,67.84 90 top
C45  82.49,137.82 90 top
C46  88.56,139.64 180 top
C47  84.39,151.79 90 top
C48  69.15,156.24 90 top
C49  78.68,149.89 90 top
C50  88.87,143.45 180 top
C51  65.34,156.24 90 top
D1  39.72,23.2 0 top
D2  41.62,45.11 270 top
D5  104.64,51.73 270 top
D6  97.73,51.55 270 top
FB1  77.64,85.04 0 top
FB2  94.19,84.95 180 top
FB3  46.91,85.71 180 top
FB4  41.83,98.09 180 top
GND  61.98,99.31 0 top
IC0  35.27,39.39 90 top
IC1  100.97,65.41 180 top
J1  7,26 270 top
J2  15,121 270 top
L1  29.74,144.69 90 top
L6  73.6,146.08 90 top
LED1  74.93,69.34 180 top
LED2  85.6,7.62 180 top
LED3  24.64,60.96 0 top
Q1  24.22,147.53 180 top
Q2  68.55,148.84 180 top
Q3  38.51,114.54 90 top
Q4  33.22,120.14 90 top
Q5  38.06,125.79 90 top
Q6  32.33,77.11 90 top
Q7  31.96,85.1 90 top
R1  73.05,58.12 180 top
R2  55.27,56.22 180 top
R3  47.65,57.49 180 top
R4  49.88,23.52 0 top
R5  51.15,54.95 270 top
R6  49.88,28.28 0 top
R7  51.78,45.42 0 top
R8  35.27,23.2 0 top
R9  51.78,49.55 0 top
R10  38.25,145.07 90 top
R11  45.61,150.72 90 top
R12  30.37,137.07 90 top
R13  24.02,141.19 90 top
R14  35.03,136.74 270 top
R15  42.93,93.98 180 top
R16  26.16,94.49 0 top
R17  26.16,90.42 0 top
R18  42.93,89.92 180 top
R19  75.95,76.71 0 top
R20  76.2,81.03 0 top
R21  95,81.03 180 top
R22  95,76.2 0 top
R23  43.27,114.54 90 top
R24  32.37,114.46 0 top
R25  37.98,120.14 90 top
R26  26.8,120.13 0 top
R27  42.97,125.79 90 top
R28  82.49,144.81 90 top
R29  88.84,151.47 90 top
R30  74.23,138.46 90 top
R31  68.52,141.95 90 top
R32  78.8,138.4 270 top
R33  31.56,125.86 0 top
R34  36.97,77.47 90 top
R35  25.79,77.13 0 top
R36  36.87,85.1 90 top
R37  25.66,84.97 0 top
R38  67.06,69.34 0 top
R39  77.72,7.62 0 top
R40  30.73,60.96 180 top
RPI  108.63,104.56 90 top
SHUNT1  100.97,59.27 180 top
U1  32.93,155.68 0 top
U2  86.03,81.64 90 top
U3  76.86,156.27 0 top
U4  34.66,93.74 90 top

### Tracks (layer width: path | path; a pad name or v marks a point on that pad's centre or on a via)
3.3V  (via drill 0.58)
  Top 0.152: R36.1 32.97,78.99 32.51,78.99 32,78.49 32,75.95 31.75,75.69 30.73,75.69 29.97,74.93 29.97,73.91 30.48,73.41 35.1,73.41 R34.1 | Q1.2 23.05,148.53 20.83,146.3 20.83,140.46 18.54,138.18 v10.16,138.18
  Top 0.254: J2.ID_0+ J2.ID_1+ | U1.16 U1.1 26.01,152.88 24.91,153.98 C7.1 | Q7.1 33.02,84.15 34.27,82.9 R36.1 41.79,77.98 68.58,77.98 71.63,81.03 71.63,81.79 74.88,85.04 FB1.1 | R34.1 34.22,75.27 Q6.1 | C45.1 82.37,136.2 R32.2 77.22,134.62 72.39,134.62 71.27,135.74 53.49,135.74 | U3.1 70.67,153.47 69.4,154.74 C48.1 | C48.1 65.41,154.74 | 65.41,154.74 C51.1 | U3.16 63.82,159.07 63.5,158.75 63.5,156.64 65.41,154.74 | C7.1 C15.1 | C7.1 24.41,153.98 23.27,152.85 Q1.2 23.27,146.46 21.59,144.78 21.59,138.43 23.5,136.53 33.66,136.53 35.08,135.1 | C48.1 69.15,151.4 Q2.2 53.49,135.74 | C18.1 35.55,135.57 35.08,135.1 | R14.2 35.33,134.85 35.08,135.1 | 53.49,135.74 53.33,135.57 C18.1 | FB1.1 76.69,87.76 76.39,88.07 | 76.39,88.07 C20.1 | C26.1 C25.1 97.95,66.34 IC1.6 v100.84,66.04 | Q5.1 39.11,124.84 | 39.11,124.84 40.36,123.59 R27.1 | 76.39,88.07 74.79,89.66 3.3V.1 3.3V.2 3.3V.3 3.3V.4 3.3V.5 3.3V.6 55.63,88.14 54.1,86.61 50.8,86.61 50.04,87.38 50.04,90.68 49.28,91.44 v49.28,98.3 | C18.1 39.26,134.22 v39.37,134.11 | 39.11,124.84 38.23,124.84 v37.59,124.21 35.81,124.21 33.27,121.67 33.27,119.89 33.97,119.19 Q4.1 34.27,119.19 35.52,117.94 R25.1 37.98,115.69 38.61,115.06 38.61,114.49 Q3.1 39.56,113.59 40.81,112.34 R23.1 49.28,106.33 v49.28,104.65 | FB1.1 78.27,86.61 v80.77,86.61 | RPI.1 109.39,80.44 108.04,81.79 105.66,81.79 104.39,83.06 v104.39,86.61
  Bottom 0.152: v10.16,138.18 10.16,136.39 10.2,136.35 10.2,129.55 J2.ID_1+
  Bottom 0.254: RPI.1 104.9,75.43 104.9,70.1 v100.84,66.04 | v39.37,134.11 37.59,132.33 v37.59,124.21 | v80.77,86.61 v104.39,86.61 | v49.28,104.65 v49.28,98.3
5V  (via drill 0.58)
  Top 0.152: v23.88,114.81 21.08,114.81 18.8,117.09 10.67,117.09 10.3,117.47 10.3,118.36 | v21.08,117.86 23.36,120.13 R26.1 24.61,120.14 v26.92,120.14 | v26.92,125.73 27.13,125.93 29.42,125.93 | R37.1 27.91,80.52 v29.72,80.52 | v48.01,83.31 47.86,83.45 47.86,85.81 | J2.ACT_EN+ 10.3,122.05 10.3,118.36 | 10.3,118.36 9.01,118.36 J2.HES_2+
  Top 0.254: J2.HES_0+ J2.HES_1+ J2.HES_2+ | 29.42,125.93 R33.1 | 23.59,85.1 R37.1 23.59,85.1 | C24.1 48.59,86.53 47.86,85.81 FB3.1 | 23.59,85.1 23.59,84.84 | 23.59,84.84 R35.1 | 23.59,84.84 21.59,86.83 21.59,105.89 R24.1 29.82,114.81 v23.88,114.81 | v51.31,71.37 80.52,71.37 v84.33,75.18
  Bottom 0.152: v21.08,117.86 21.08,116.59 22.86,114.81 v23.88,114.81 | v26.92,120.14 v26.92,125.73 | v29.72,80.52 32.51,83.31 v48.01,83.31
  Bottom 0.254: v48.01,83.31 48.01,74.68 v51.31,71.37 | v84.33,75.18 88.39,75.18 90.42,73.15 98.3,73.15 102.62,77.47 105.16,77.47 107.36,79.68 RPI.2
24V+  (via drill 0.6)
  Top 1.27: R40.1 32.26,60.84 32.26,58.17
  Bottom 1.27: J1.24V+ 13.97,54.61 25.4,54.61 33.37,46.65 v33.37,43.52
  other vias: 34.63,43.52 35.91,43.52 37.17,43.52 33.37,42.25 34.63,42.25 35.91,42.25 37.17,42.25 33.37,40.98 34.63,40.98 35.91,40.98 37.17,40.98 33.37,39.71 34.63,39.71 35.91,39.71 37.17,39.71
  pour Top (rank 2, no thermals): 21.93,25.74 38.45,25.74 38.45,32.09 35.91,32.09 35.91,37.17 38.45,37.17 38.45,42.57 45.75,42.57 45.75,58.76 21.93,58.76
  pour Bottom (no thermals): 21.93,58.44 38.45,58.76 38.45,28.6 21.93,28.6
A0+  (via drill 0.58)
  Top 0.254: v23.62,106.17 24.64,105.16 29.21,105.16 30.99,103.38 52.07,103.38 v56.13,107.44 | v85.09,140.72 84.38,140.72 R28.1
  Bottom 0.152: J2.A0+ 14.02,106.17 v23.62,106.17
  Bottom 0.254: v56.13,107.44 62.99,107.44 85.09,129.54 v85.09,140.72
A0-  (via drill 0.58)
  Top 0.254: v25.4,104.14 27.43,104.14 29.21,102.36 52.83,102.36 v61.47,111 | v85.6,148.59 86.28,149.28 R29.1
  Bottom 0.254: J2.A0- 13.76,103.89 25.15,103.89 v25.4,104.14 | v85.6,148.59 78.21,148.59 61.47,131.85 v61.47,111
A1+
  Top 0.254: R10.1 38.25,143.44 36.23,145.45 36.23,151.39 35.47,152.15 35.47,153.78 31.66,157.58 31.66,159.21 31,159.87 19.82,159.87 4.23,144.28 4.23,105.31 5.71,103.83 14.29,103.83 16.07,105.61 16.07,107.78 J2.A1+
A1-
  Top 0.254: R11.1 46.06,148.52 47.29,149.75 47.29,153.96 46.76,154.49 36.18,154.49 32.93,157.75 32.93,159.21 31.82,160.33 19.63,160.33 3.77,144.47 3.77,105.11 5.52,103.37 14.48,103.37 16.52,105.42 16.52,109.17 14.54,111.16 12.8,111.16 J2.A1-
ACT_EN_3.3  (via drill 0.58)
  Top 0.254: Q5.2 39.36,126.74 40.61,127.99 R27.2 44.48,127.99 v45.97,126.49
  Bottom 0.254: RPI.36 81.45,123.61 64.45,106.62 54.17,106.62 45.97,114.81 v45.97,126.49
ACT_EN_S
  Top 0.254: R33.2 33.83,125.79 34.04,125.79 | Q5.3 34.04,125.79 | J2.ACT_EN 31.6,123.35 34.04,125.79
ACT_LIM_END
  Top 0.254: Q4.3 29.21,120.13 | 29.21,120.13 R26.2 | J2.END 21.54,120.85 23.11,122.43 26.91,122.43 29.21,120.13
ACT_LIM_HOM
  Top 0.152: J2.HOM 11.74,120.85 12.95,119.63 17.78,119.63 20.57,116.84 32.19,116.84 R24.2
  Top 0.254: Q3.3 37.34,114.46 R24.2
ACT_OUT+
  Top 0.254: IC1.8 98.37,63.39 SHUNT1.2 97.73,58.63 D6.1
  Top 1.27: J1.ACT_OUT+ 15.88,43.2 15.88,60.33 22.23,66.67 65.53,66.67 | 65.53,66.67 84.94,66.67 92.34,59.27 SHUNT1.2 | R38.1 65.66,66.8 65.53,66.67
ACT_OUT-  (via drill 0.6)
  Top 0.813: C8.1 64.8,14.63 v64.8,21.87
  Top 1.27: J1.ACT_OUT- 17.14,24.43 17.14,9.65 20.7,6.1 65.15,6.1 | BTN8982_UP.TAB 68.9,9.85 65.15,6.1 | R39.1 74.8,6.1 65.15,6.1
  other vias: 67.59,21.87 70.13,21.87 72.67,21.87 68.86,23.14 71.4,23.14 73.94,23.14 67.59,24.41 70.13,24.41 72.67,24.41 66.07,23.14 63.53,23.14 64.8,24.41 66.07,25.93 68.86,26.18 71.4,26.18 73.94,26.18 63.53,25.93 64.8,27.45 67.59,27.45 70.13,27.45 72.67,27.45 63.53,28.98 66.07,28.98 68.86,28.98 71.4,28.98 73.94,28.98 72.67,30.5 70.13,30.5 67.59,30.5 64.75,30.51
  pour Top (no thermals): 62.89,31.45 89.56,31.45 89.56,13.99 62.89,13.99
  pour Bottom (no thermals): 62.58,31.45 79.72,31.45 81.31,29.87 89.56,29.87 89.56,13.99 62.58,13.99
ADDR
  Top 0.152: U2.1 92.59,76.2 R22.1
AIN0
  Top 0.254: U2.4 88.1,82.1 87.36,82.1 85.85,80.59 85.85,70.61 88.65,67.82 97.75,67.82 IC1.5
ALERT_3.3V
  Top 0.152: R21.2 88.26,81.03 U2.2
ALERT_5V
  Top 0.152: 39.99,93.24 R15.2 39.99,93.24 | 39.99,93.24 U4.2
CH_A
  Top 0.254: J1.CH_A 1.14,56.22 1.14,55.37 1.14,11.3 10.67,1.78 102.62,1.78 112.52,11.68 112.52,90.52 RPI.11
CH_B  (via drill 0.58)
  Top 0.254: J1.CH_B 1.78,54.36 1.78,12.19 10.92,3.05 101.35,3.05 v111,12.7
  Bottom 0.254: v111,12.7 111,75.95 112.52,77.47 112.52,93.06 RPI.13
CURRENT_DOWN  (via drill 0.58, 0.8)
  Top 0.254: v82.3,82.8 83.76,82.8 U2.6
  Top 0.813: 52.63,44.16 BTN8982_DOWN.6 60.99,44.16 61.94,43.2 61.94,38.76 62.89,37.8 62.89,33.04 v61.3,31.45 | 52.63,44.16 C10.1 | 52.63,44.16 R7.2
  Bottom 0.254: v61.3,31.45 61.3,30.82 60.67,30.18 60.67,19.07 64.48,15.26 70.08,15.26 74.17,11.18 90.93,11.18 94.23,14.48 94.23,63.25 79.25,78.23 79.25,81.03 81.03,82.8 v82.3,82.8
CURRENT_UP  (via drill 0.58, 0.8)
  Top 0.254: v88.14,83.82 v88.15,83.81 U2.5
  Top 0.813: v61.94,20.02 61.94,23.2 61.3,23.84 BTN8982_UP.6 51.04,23.84 R4.2 C9.1
  Bottom 0.254: v61.94,20.02 65.11,16.85 70.83,16.85 75.23,12.45 90.68,12.45 92.96,14.73 92.96,62.74 78.23,77.47 78.23,81.53 80.52,83.82 v88.14,83.82
DAT0
  Top 0.254: U3.12 77.5,160.68 78.11,161.29 93.34,161.29 107.36,147.27 RPI.40
DAT1
  Top 0.254: U1.12 33.56,160.56 34.92,161.93 93.98,161.93 111.51,144.4 111.51,125.22 RPI.35
E0+  (via drill 0.58)
  Top 0.254: C46.1 90.37,139.96 C50.1 90.37,143.08 v88.9,141.6 | L6.1 73.66,144.41 v73.66,142.88 | v25.91,102.87 27.43,101.35 54.36,101.35 v62.74,109.73
  Bottom 0.254: v88.9,141.6 87.63,142.88 v73.66,142.88 70.36,139.57 70.36,117.35 v62.74,109.73 | J2.E0+ 12.28,102.87 v25.91,102.87
E1+  (via drill 0.58)
  Top 0.254: C13.1 45.41,139.28 C17.1 45.41,143.2 v43.81,141.6 | L1.1 29.74,141.71 v29.84,141.6
  Bottom 0.254: v43.81,141.6 v29.84,141.6 28.19,139.95 7.62,139.95 3.56,135.89 3.56,109.73 5.33,107.95 7.1,107.95 J2.E1+
EN_DOWN  (via drill 0.58)
  Top 0.254: v51.31,65.02 51.15,64.86 R5.1 | v104.39,88.39 104.39,112.78 106.43,114.81 108.2,114.81 108.81,115.41 108.81,116.45 109.9,117.54 RPI.31
  Bottom 0.254: v51.31,65.02 74.68,88.39 v104.39,88.39
EN_UP  (via drill 0.58)
  Top 0.254: R3.1 v48.5,65.01 v48.51,65.02 | v105.41,93.22 105.41,111 106.68,112.27 107.72,112.27 108.81,113.36 108.81,113.91 109.9,115 RPI.29
  Bottom 0.254: v48.51,65.02 75.95,92.46 104.65,92.46 v105.41,93.22
END_3.3  (via drill 0.58)
  Top 0.152: R25.2 40.22,122.34 42.16,120.4 67.06,120.4 85.85,101.6 v89.15,98.3
  Top 0.254: R25.2 35.52,122.34 34.27,121.09 Q4.2
  Bottom 0.152: v89.15,98.3 107.28,98.3 RPI.16
GND  (via drill 0.58, 0.8)
  Top 0.152: GND.1 51.64,95.33 51.64,89.42 C24.2 | FB2.1 96.78,83.31 98.3,83.31 100.33,81.28 100.33,75.44 94.27,69.37 C25.2 | FB4.1 44.61,96.27 v44.7,96.27 | J2.HES_2- J2.28
  Top 0.254: R8.1 32.09,23.2 28.29,19.39 28.29,10.51 26.04,8.26 v21.59,8.26 | J2.E0- J2.E1- J2.HES_0- J2.HES_1- J2.HES_2- 6.5,119 5.2,120.31 5.2,121.39 6.5,122.7 J2.ACT_EN- J2.ID_0- J2.ID_1- 6.5,129 5.2,130.31 5.2,133.89 6.5,135.2 J2.GO- 7.8,137.16 21.66,137.16 23.7,135.12 30.12,135.12 R12.1 v32.76,134.87 v32.77,134.87 | 42.49,143.32 42.73,143.09 C13.2 42.34,138.57 C18.2 39.01,138.57 38.64,138.94 R14.1 | 42.49,143.32 C17.2 | R32.1 78.68,140.73 C49.1 78.43,148.39 77.35,149.47 77.35,153.32 U3.5 77.5,154.37 74.96,156.91 U3.14 U3.15 73.69,158.77 72.65,157.74 C48.2 C51.2 66.87,156.21 v67.06,156.21 | R32.1 80.96,140.6 82.24,139.32 C45.2 86.74,139.32 C46.2 | C50.2 87.37,139.96 C46.2 | C15.2 C7.2 24.91,156.98 27.34,159.41 29.12,159.41 29.75,158.78 U1.15 U1.14 31.02,156.32 33.56,153.78 U1.5 33.49,152.81 33.49,148.08 34.57,147 C16.1 35.03,146.78 R14.1 | C46.2 87.06,137.22 v87,137.16 | C26.2 C25.2 101.21,69.34 103.24,67.31 IC1.4 104.65,67.31 105.41,66.55 105.41,65.28 104.9,64.77 IC1.2 103.24,64.77 102.09,63.61 102.09,52.12 104.64,49.58 D5.2 97.91,49.52 D6.2 97.79,49.29 v97.79,47.24 | J1.RPI_ESTOP- 6.67,31.75 4.19,31.75 3.17,30.73 3.17,12.7 7.62,8.26 v15.24,8.26 | J1.RE_BUT- J1.RE- J1.ACE- 7.25,54.58 J1.24V- 10.5,52.41 v14.48,56.39 | v44.7,145.54 42.49,143.32 | R32.1 74.46,136.26 R30.1 | RPI.6 108.81,86.96 108.81,88.51 109.9,89.6 RPI.9 108.45,92.04 108.45,93.59 107.36,94.68 RPI.14 108.71,97.03 108.71,101.85 107.36,103.2 RPI.20 107.36,103.81 108.71,105.16 108.71,109.72 RPI.25 | RPI.39 108.71,127.5 108.71,122.42 RPI.34 | v97.28,84.84 95.25,84.84 FB2.1 95.14,85.05 91.98,88.21 C20.2 68.33,98.93 GND.6 GND.5 GND.4 GND.3 GND.2 GND.1 46.23,99.31 44.7,97.79 v44.7,96.27
  Top 0.254: R14.1 33.27,138.94 v32.77,139.45 | v78.13,39.71 78.22,39.62 v96.27,39.62 96.27,16.79 LED2.1 | LED1.1 83.06,69.34 v83.31,69.09 | LED3.1 22.63,60.45 20.32,60.45 18.8,58.93 v18.8,56.64
  Top 0.813: v74.96,33.36 76.55,33.36 | 76.55,33.36 v78.13,33.36 | C2.1 76.55,33.36 | v49.56,44.47 v49.56,43.2 C10.2 | v49.56,48.6 v49.56,47.33 C11.1 | v47.65,26.69 47.65,26.06 | 47.65,26.06 v47.65,25.42 | C12.1 47.65,26.06 | v57.81,16.53 59.4,16.53 | 59.4,16.53 v60.99,16.53 | C3.1 59.4,16.53 | v58.13,37.17 59.72,37.17 | 59.72,37.17 v61.3,37.17 | C1.1 59.72,37.17 | R6.1 47.97,28.28 v47.65,27.96 | R9.1 50.61,49.87 v49.56,49.87 | R7.1 50.61,45.74 v49.56,45.74 | v47.65,22.25 47.65,21.61 | 47.65,21.61 v47.65,20.98 | v74.96,39.71 76.55,39.71 | 76.55,39.71 v78.13,39.71 | C5.1 76.55,39.71 | C9.2 47.65,21.61 | R4.1 v47.65,23.52 | R8.1 34.54,23.08 v34.54,21.59
  Top 1.016: v43.84,47.97 v43.84,46.7 43.84,47.61 D2.A
  Bottom 0.254: v87,137.16 101.44,137.16 RPI.39 | v15.24,8.26 v21.59,8.26 | v67.06,156.21 56.39,145.54 v44.7,145.54 | J1.24V- 13.72,48.11 13.72,36 12.08,34.37 9.29,34.37 J1.RPI_ESTOP- | RPI.25 108.71,112.11 108.71,114.64 RPI.30 108.71,117.34 108.71,119.72 RPI.34 | RPI.6 97.96,85.52 v97.28,84.84 | v32.77,134.87 v32.77,139.45 | v97.79,47.24 97.79,41.15 v96.27,39.62 | v83.31,69.09 91.44,60.96 91.44,37.85 90.93,37.34 87.88,37.34 | v18.8,56.64 14.73,56.64 v14.48,56.39
  other vias: 56.54,51.77 56.54,31.45 57.81,51.77 59.08,51.77 59.08,53.05 57.81,53.05 56.54,53.05 57.81,31.45 59.08,31.45 59.08,32.73 57.81,32.73 56.54,32.73
  pour Bottom (no thermals): 39.72,62.57 39.72,10.5 61.3,10.5 61.3,62.57
  pour Bottom (no thermals): 61.3,40.66 61.3,32.41 80.04,32.41 81.31,31.14 89.25,31.14 89.25,41.93 80.67,41.93 79.4,40.66
  pour Bottom (isolate 0.406, no thermals): 39.72,27.64 22.13,27.64 22.13,17.7 39.72,17.7
  pour Top (no thermals): 60.03,50.51 56.23,50.51 56.23,53.36 60.03,53.36
  pour Top (no thermals): 60.03,30.18 56.23,30.18 56.23,33.04 60.03,33.04
GNDADC1
  Top 0.152: FB2.2 94.23,83.96 94.23,79.16 R22.2
  Top 0.254: FB2.2 92.7,84.95 89.39,81.64 U2.3 88.1,81.6 87.51,81.6 87.32,81.41 87.32,80.38 87.33,80.36 C19.1
GNDADC2
  Top 0.152: 38.12,89.52 40.33,89.52 R18.2
  Top 0.254: C23.1 40.03,99.04 40.88,98.19 FB4.2 40.88,97.26 37.36,93.74 U4.3 35.7,93.74 35.43,93.47 35.43,92.2 38.12,89.52
GO_S  (via drill 0.58)
  Top 0.152: v84.56,90.09 60.6,114.05 v60.2,114.05
  Top 0.254: v40.96,133.18 21.75,133.18 19.08,135.85 J2.GO
  Bottom 0.152: v60.2,114.05 60.2,116.59 43.6,133.18 v40.96,133.18
  Bottom 0.254: v84.56,90.09 105.89,90.09 106.68,89.3 108.66,89.3 RPI.7
HES_0  (via drill 0.58)
  Top 0.254: v34.54,91.69 34.98,92.13 34.98,93.66 35.55,94.24 U4.4
  Bottom 0.254: v34.54,91.69 34.54,92.84 30.8,96.59 30.8,100.77 18.22,113.35 J2.HES_0
HES_1  (via drill 0.58)
  Top 0.254: v35.56,96.01 36.77,94.8 U4.5
  Bottom 0.254: J2.HES_1 16.54,115.85 31.27,101.12 31.27,97.05 32.31,96.01 v35.56,96.01
HES_2  (via drill 0.58)
  Top 0.254: U4.6 32.26,95.02 v32.26,98.04
  Bottom 0.254: v32.26,98.04 32.26,101.57 15.48,118.35 J2.HES_2
HOME_3.3  (via drill 0.58)
  Top 0.254: Q3.2 39.66,115.49 40.91,116.74 R23.2 43.27,115.99 51.56,107.7 v51.56,104.65
  Bottom 0.254: RPI.18 102.44,100.75 99.82,103.38 52.83,103.38 v51.56,104.65
IN2  (via drill 0.58, 0.6)
  Top 0.813: BTN8982_UP.2 v54.64,28.91 | v53.05,56.22 R2.2 | v20.35,59.08 v20.35,16.85
  Bottom 0.813: v54.64,28.91 54,28.28 54,27.01 53.05,26.06 53.05,15.58 51.78,14.31 40.67,14.31 39.4,15.58 35.59,15.58 32.09,12.09 25.11,12.09 v20.35,16.85 | v53.05,56.22 46.7,56.22 45.43,57.49 35.91,57.49 31.46,61.94 23.2,61.94 v20.35,59.08
INH1
  Top 0.813: BTN8982_DOWN.3 55.27,47.97 54,49.23 54,50.72 51.15,53.58 R5.2
INH2  (via drill 0.58, 0.6)
  Top 0.813: BTN8982_UP.3 v52.73,27.64 | v19.08,51.46 17.55,52.98 17.55,58.82 22.57,63.84 32.6,63.84 38.95,57.49 R3.2 | v27.02,13.36 21.93,13.36 v19.71,15.58
  Bottom 0.813: v52.73,27.64 51.78,26.69 51.78,16.21 51.15,15.58 40.98,15.58 39.72,16.85 35.27,16.85 31.78,13.36 v27.02,13.36 | v19.08,51.46 19.08,16.21 v19.71,15.58
MISO
  Top 0.254: J2.ID_MISO_1 J2.ID_MISO_0
  Bottom 0.254: RPI.21 111,104.74 111,97.76 110.01,96.78 109.46,96.78 108.63,95.95 108.63,95.4 107.81,94.58 42.22,94.58 16.03,120.77 16.03,123.82 J2.ID_MISO_0
MOSI  (via drill 0.58)
  Top 0.152: v85.34,104.65 84.84,105.16 84.84,110.74 66.04,129.54 14.51,129.54 14.5,129.55 13.5,129.55 13.49,129.54 12.69,129.54 J2.ID_MOSI_1
  Top 0.254: J2.ID_MOSI_1 J2.ID_MOSI_0
  Bottom 0.152: RPI.19 108.55,104.65 v85.34,104.65
N$1
  Top 0.813: BTN8982_DOWN.2 58.56,49.55 60.78,49.55 61.21,49.98 61.21,55.88 63.46,58.12 R1.2
N$2
  Top 0.254: U1.2 29.75,152.58 25.7,148.53 Q1.1
N$3
  Top 0.254: R13.1 24.3,139.27 R12.2 30.82,139.27 32.29,140.74 U1.4
N$4
  Top 0.254: C16.2 34.82,152.87 U1.6
N$5
  Top 0.254: R13.2 24.02,146.23 Q1.3 24.36,146.29 L1.2 30.14,146.29 31.02,147.17 U1.3
N$6
  Top 0.254: U1.7 36.1,152.58 38.25,150.44 R10.2 38.9,147.27 C14.1
N$7
  Top 0.254: U1.8 40.82,152.88 C14.2 41.55,152.92 R11.2
N$8
  Top 1.27: R38.2 LED1.2
N$9
  Top 1.016: IC0.P1 32.99,29.93 36.86,26.06 36.86,23.2 | D1.A 36.86,23.2 | 36.86,23.2 R8.2
N$10
  Top 1.27: R39.2 LED2.2
N$11
  Top 1.27: R40.2 LED3.2
N$56
  Top 0.254: U3.2 73.69,153.17 70.36,149.84 Q2.1
N$63
  Top 0.254: U3.4 76.23,142.2 74.68,140.66 R30.2 73.78,140.66 72.88,139.75 R31.1
N$64
  Top 0.254: U3.6 78.77,151.48 C49.2
N$65
  Top 0.254: U3.3 74.96,151.18 73.6,149.82 L6.2 73.53,147.75 Q2.3 68.55,144.19 R31.2
N$67
  Top 0.254: U3.7 80.67,152.84 80.67,148.37 82.04,147.01 R28.2 82.49,148.64 84.14,150.29 C47.1
N$68
  Top 0.254: R29.2 88.45,153.29 C47.2 81.49,153.29 U3.8
OUT_DOWM
  pour Bottom (no thermals): 62.58,59.08 87.02,59.08 87.02,49.87 89.56,47.33 89.56,43.2 80.67,43.2 79.08,41.62 62.58,41.62
OUT_DOWN  (via drill 0.58, 0.8)
  Top 0.254: IC1.1 103.57,63.39 103.57,59.69 SHUNT1.1 103.57,58.48 104.64,57.41 D5.1
  Top 0.813: C6.1 v61.3,35.58 | v64.16,35.58 64.16,41.76 v63.75,42.16
  Top 1.27: 103.57,59.69 107.95,55.31 107.95,47.24 106.39,45.68 69.92,45.68 BTN8982_DOWN.TAB
  Bottom 0.813: v61.3,35.58 v64.16,35.58
  other vias: 63.75,51.31 66.29,51.31 68.83,51.31 71.37,51.31 73.91,51.31 65.02,50.04 67.56,50.04 66.29,48.51 63.75,48.51 68.83,48.51 71.37,48.51 73.91,48.51 70.1,50.04 72.64,50.04 65.02,46.99 67.56,46.99 70.1,46.99 72.64,46.99 63.75,45.21 66.29,45.21 68.83,45.21 71.37,45.21 73.91,45.21 65.02,43.69 67.56,43.69 70.1,43.69 72.64,43.69 73.91,42.16 71.37,42.16 68.83,42.16 66.29,42.16
  pour Top (isolate 0.406, no thermals): 62.89,41.62 89.56,41.62 89.56,47.33 87.02,49.87 87.02,59.08 62.89,59.08
PWM_DOWN  (via drill 0.58)
  Top 0.254: R1.1 79.08,58.12 81.37,55.84 95.72,55.84 v95.76,55.88 | RPI.32 102.87,114.04 v102.87,72.64
  Bottom 0.254: v95.76,55.88 98.55,58.67 98.55,68.33 v102.87,72.64
PWM_UP  (via drill 0.58)
  Top 0.254: R2.1 60.86,60.96 85.85,60.96 89.15,57.66 v95.5,57.66 | v101.35,74.17 101.35,114.55 106.68,119.89 108.72,119.89 RPI.33
  Bottom 0.254: v95.5,57.66 97.28,59.44 97.28,70.1 v101.35,74.17
ROT_EN_BUT  (via drill 0.58)
  Top 0.254: v91.95,93.73 91.95,113.79 104.31,126.16 RPI.38
  Bottom 0.254: J1.RE_BUT 2.79,51.29 2.79,59.72 8.52,65.45 12.62,65.45 40.89,93.73 v91.95,93.73
RPI_STOP_S
  Bottom 0.254: J1.RPI_ESTOP 7,7.48 9.91,4.57 99.57,4.57 109.73,14.73 109.73,76.96 111.76,78.99 111.76,85.6 110.49,86.87 108.55,86.87 RPI.8
RST0
  Bottom 0.254: RPI.15 108.81,97.12 43.66,97.12 17.05,123.74 17.05,127.8 J2.ID_RST_0
RST1
  Bottom 0.254: RPI.22 36.18,105.83 18.57,123.44 18.57,128.78 J2.ID_RST_1
SCK  (via drill 0.58)
  Top 0.152: v7.87,138.18 v7.87,140.97
  Bottom 0.152: J2.ID_SCK_0 J2.ID_SCK_1 7.8,134.55 7.8,138.1 v7.87,138.18 | v7.87,140.97 7.87,149.35 20.83,162.31 95.25,162.31 112.27,145.29 112.27,110.74 RPI.23
SCK0  (via drill 0.58)
  Top 0.254: U3.11 79.41,158.43 79.41,158.34 81.28,156.46 90.68,156.46 90.68,145.61 91.96,144.33 91.96,138.82 90.68,137.54 v90.68,91.19
  Bottom 0.254: v90.68,91.19 105.41,91.19 RPI.12
SCK1  (via drill 0.58)
  Top 0.254: U1.11 34.92,158.57 v34.92,160.02
  Bottom 0.254: v34.92,160.02 36.2,161.29 93.34,161.29 111.51,143.13 111.51,127.76 RPI.37
SCL  (via drill 0.58)
  Top 0.152: U2.10 83.1,79.83 v82.55,79.83 79.43,76.71 78.23,76.71 | 78.23,76.71 R19.2 | 78.23,76.12 78.23,76.71 | v19.81,107.19 19.81,77.98 v23.62,74.17
  Top 0.254: J1.ACE_SCL 9.47,54.61 11.43,54.61 13.97,57.15 13.97,61.21 v23.88,71.12 | v31.5,74.42 32.51,75.44 32.51,77.24 Q6.2 34.95,79.67 R34.2 42.47,74.17 76.28,74.17 78.23,76.12
  Bottom 0.152: J2.3 9,138.57 8.38,139.19 7.62,139.19 4.83,136.4 4.83,132.52 J2.12 4.83,129.18 4.83,112.52 5.84,111.51 17.53,111.51 19.81,109.22 v19.81,107.19 | v23.62,74.17 23.62,71.37 v23.88,71.12
  Bottom 0.254: RPI.5 108.45,84.07 106.91,84.07 102.67,79.83 v82.55,79.83 | v23.88,71.12 27.18,74.42 v31.5,74.42
SCL_5V
  Top 0.152: U4.10 30.68,92.74 R17.2 32,86.78 32,84.07 31.23,83.3 Q6.3
  Top 0.254: Q6.3 28,77.11 R35.2
SDA  (via drill 0.58)
  Top 0.152: U2.9 83.8,81.03 80.26,81.03 | 80.26,81.03 R20.2 76.71,81.03 | v80.26,80.27 80.26,81.02 80.26,81.03 | 76.71,81.03 v76.45,80.77 76.71,81.03 | J2.2 10.7,135.85 9.5,134.65 7.8,134.65 J2.8 7.8,132.05 7.8,105.65 7.87,105.57 v7.87,104.65 | v32,88.65 32.97,87.69 Q7.2
  Top 0.254: Q7.2 33.27,86.05 34.52,87.3 R36.2 44.96,79.21 67.52,79.21 v69.09,80.77 | v61.21,72.64 20.06,72.64 12.87,65.45 10.45,65.45 9.11,64.11 9.11,61.69 J1.ACE_SDA
  Bottom 0.152: v7.87,104.65 10.41,102.11 20.57,102.11 32,90.68 v32,88.65
  Bottom 0.254: v80.26,80.27 81.78,78.75 104.13,78.75 106.91,81.53 108.45,81.53 RPI.3 | v76.45,80.77 v69.09,80.77 69.09,80.52 v61.21,72.64
SDA1  (via drill 0.58)
  Top 0.152: J2.ID_SDA_1 12.77,134.62 19.3,134.62 22.1,131.83 67.31,131.83 88.39,110.74 v88.39,108.46 | J2.ID_SDA_0 12.73,132.08 20.83,132.08 22.1,130.81 66.55,130.81 86.36,111 v86.36,107.19
  Bottom 0.152: v88.39,108.46 107.28,108.46 RPI.24 106.17,107.19 105.66,107.19 v86.36,107.19
SDA_5V
  Top 0.152: R37.2 26.16,86.67 26.16,92.29 R16.2 28.36,94.45 29.57,93.24
  Top 0.254: Q7.3 30.74,84.97 R37.2 | U4.9 29.57,93.24
SR1
  Top 0.813: R9.2 C11.2 53.37,47.33 55.27,45.42 BTN8982_DOWN.5
SR2
  Top 0.813: BTN8982_UP.5 54.32,25.11 53.37,26.06 C12.2 R6.2
VDD_ADC1  (via drill 0.58)
  Top 0.152: FB1.2 74.58,81.03 R20.1 74,76.96 R19.1 | v95.25,81.03 R21.1
  Top 0.254: 78.59,84.94 81.89,81.64 U2.8 83.96,81.6 84.56,81.6 84.75,81.41 84.75,81.03 | 78.59,84.94 FB1.2 78.59,84.94 | 84.75,81.03 84.75,78.5 C19.2 | 84.75,81.03 84.75,82.46 87.12,84.84 90.68,84.84 v90.93,84.58
  Bottom 0.254: v90.93,84.58 92.2,83.31 94.49,81.03 v95.25,81.03
VDD_ADC2  (via drill 0.58)
  Top 0.152: v36.97,91.83 42.98,91.83 R15.1 | C23.2 27.84,97.03 28.7,97.03 32.03,93.7 32.59,93.7 | FB3.2 45.96,85.81 45.13,86.65 45.13,89.66 R18.1 R15.1 | R17.1 R16.1 23.96,96.4 27.73,100.17 40.52,100.17 41.83,98.86 41.83,96.3 44.15,93.98 R15.1
  Top 0.254: U4.8 32.59,93.7 33.18,93.7 33.53,93.35 v33.53,90.42 | v36.97,91.83 36.77,92.03 U4.1
  Bottom 0.254: v33.53,90.42 35.56,90.42 v36.97,91.83
VS
  Top 1.27: 41.62,38.76 41.62,35.09 IC0.P3
  Top 2.54: 41.62,38.76 D2.K
  pour Top (no thermals): 48.6,42.88 57.18,42.88 57.18,35.58 51.15,30.5 47.97,30.5 47.97,22.57 56.86,22.57 56.86,14.31 39.72,14.31 39.72,33.36 40.35,33.36 40.35,40.98 46.06,40.98
  pour Top (no thermals): 40.35,36.22 37.17,36.22 37.17,32.09 40.35,32.09
  pour Top (no thermals): 57.18,22.57 60.03,22.57 60.03,19.07 57.18,19.07
  pour Top (no thermals): 57.18,42.88 60.03,42.88 60.03,39.08 57.18,39.08

### Text on the board
tPlace: .1uF | .1uF | .1uF | 10uF | 100 | 100 | .1uF | .1uF | .1uF | 40V | 40V | 3.3uH | 100 | 100 | 3.3.uH | .1uF | 20k | .1uF | 20k | .1uF | 8.2k | 10k | 10uF | 8.2k | 10k | 10uF | 10uF | .1uF | 10k | 10k | 50V | FormaPath, Inc. | 10k | 50V | AdiPress Control Board #1061 / Version Date: 12/28/2022 | 10k | Designed By Katie Brandegee | 10k | 10k | 50V | 1uF | 10k | ADS | 10k | 10k | 10k | 1uF | 1uF | 10k | 10k | 50V | 10k | ADS | 10k | 10k | 10k | 50V | 10k | 10k | 1uF | stripe | 680 | LED | .1uF | INA240 | LED | 680 | stripe | 10k | 10k | 100u | 10k | 10k | stripe | stripe | .51k | 39V | 100n | 1k | stripe | 1n | 100n | 220n | 220n | 220n | .51k | 100n | 10k | 10V | 1k | 1n | stripe | 100n | 220n | 680 | LED | stripe
tNames: + | - | -
tValues: FB | ADS | FB | FB | Shunt